# Altium project Mercury_AD_BaseBoard.PrjPcb (part 3 of 4)

## Sheet fastADCs.SchDoc
size A; SheetNumber: 4; SheetTotal: 24
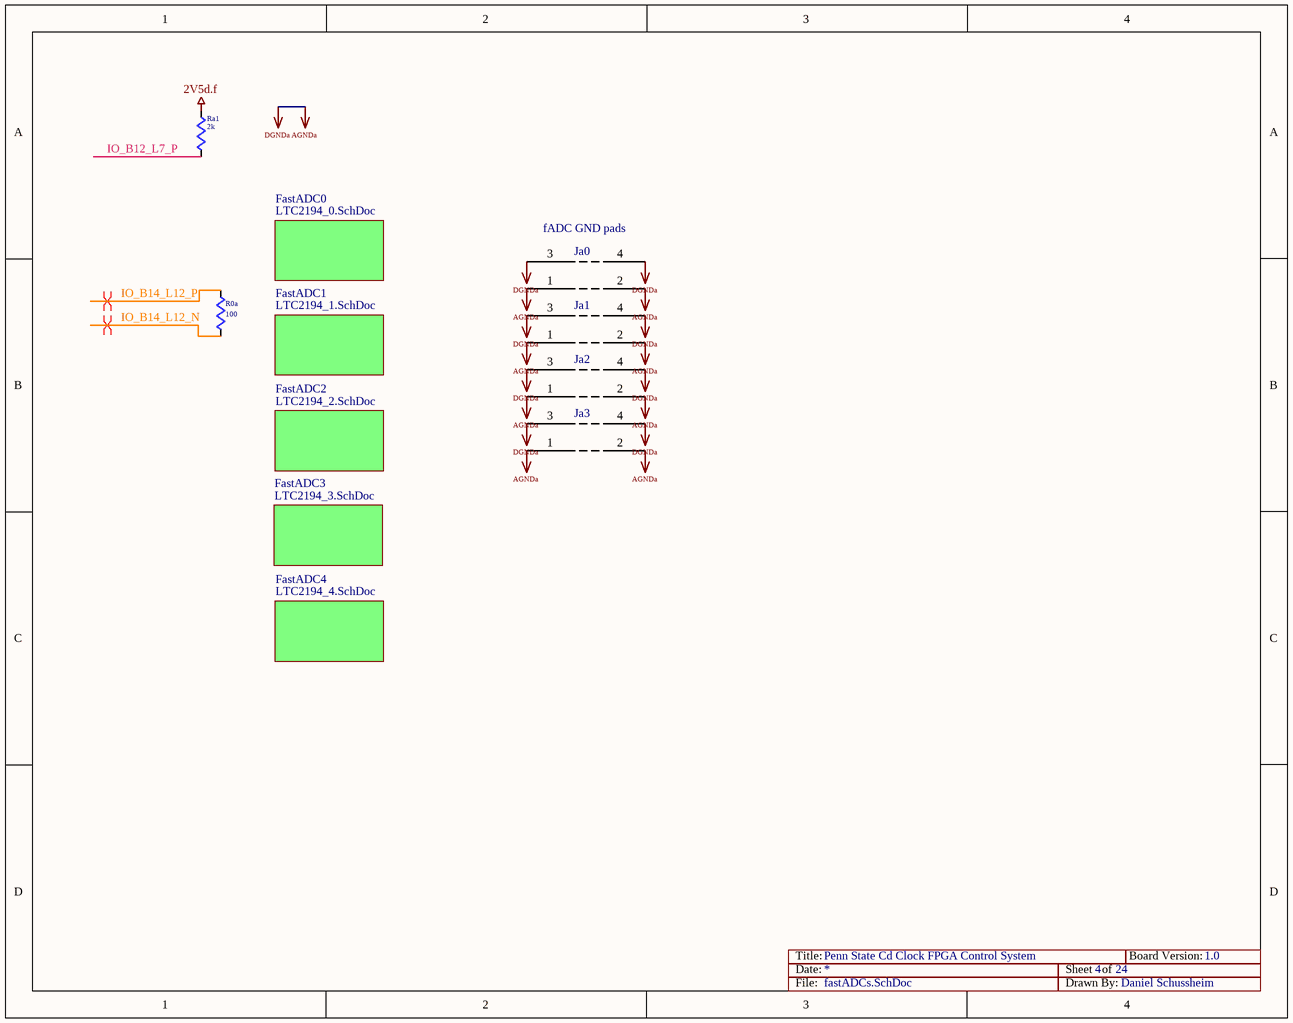
[diagram p17: fastADCs.SchDoc]

### Parts
Ja0  fADC GND pads  [FADC_GND_CONN]
Ja1  fADC GND pads  [FADC_GND_CONN]  (value not drawn)
Ja2  fADC GND pads  [FADC_GND_CONN]  (value not drawn)
Ja3  fADC GND pads  [FADC_GND_CONN]  (value not drawn)
R0a  100  [0402]
Ra1  2k  [0603]

### Sub-sheets
FastADC0 = LTC2194_0.SchDoc: no entries
FastADC1 = LTC2194_1.SchDoc: no entries
FastADC2 = LTC2194_2.SchDoc: no entries
FastADC3 = LTC2194_3.SchDoc: no entries
FastADC4 = LTC2194_4.SchDoc: no entries

### Nets
2V5d.f: Ra1.1
AGNDa: Ja0.1 Ja0.2 Ja0.3 Ja0.4 Ja1.1 Ja1.2 Ja1.3 Ja1.4 Ja2.1 Ja2.2 Ja2.3 Ja2.4 Ja3.1 Ja3.2 Ja3.3 Ja3.4  [also labelled DGNDa]
IO_B12_L7_P: Ra1.2
IO_B14_L12_N: R0a.2
IO_B14_L12_P: R0a.1

### Layout directives
differential pair: IO_B14_L12_N, IO_B14_L12_P

### Notes on the sheet
- Title:
- Date:
- Sheet
- of
- Board Version:
- File:
- Drawn By:

### Library data of the parts
R0a Ra1 = RES

## Sheet LTC2194_0.SchDoc
size A; DrawnBy: Daniel Schussheim; DocumentNumber: 2; SheetNumber: 5; SheetTotal: 24
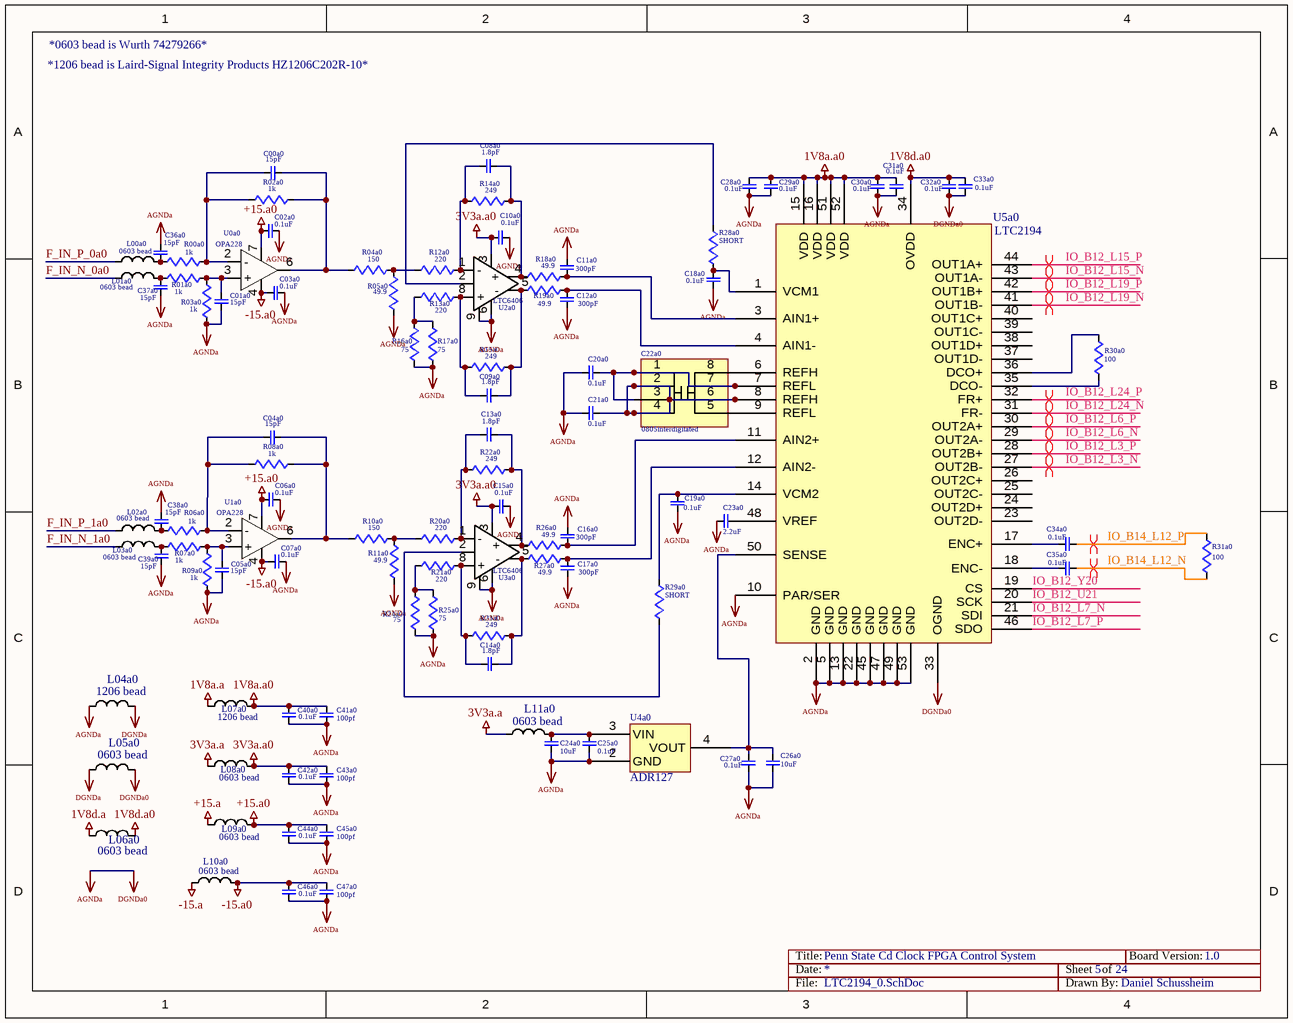
[diagram p18: LTC2194_0.SchDoc]

### Parts
C00a0  15pF  [0603]
C01a0  15pF  [0603]
C02a0  0.1uF  [0603]
C03a0  0.1uF  [0603]
C04a0  15pF  [0603]
C05a0  15pF  [0603]
C06a0  0.1uF  [0603]
C07a0  0.1uF  [0603]
C08a0  1.8pF  [0603]
C09a0  1.8pF  [0603]
C10a0  0.1uF  [0603]
C11a0  300pF  [0603]
C12a0  300pF  [0603]
C13a0  1.8pF  [0603]
C14a0  1.8pF  [0603]
C15a0  0.1uF  [0603]
C16a0  300pF  [0603]
C17a0  300pF  [0603]
C18a0  0.1uF  [0402]
C19a0  0.1uF  [0402]
C20a0  0.1uF  [0402]
C21a0  0.1uF  [0402]
C22a0  0805interdigitated  [0805int]
C23a0  2.2uF  [0402]
C24a0  10uF  [0603]
C25a0  0.1uF  [0603]
C26a0  10uF  [0603]
C27a0  0.1uF  [0603]
C28a0  0.1uF  [0402]
C29a0  0.1uF  [0402]
C30a0  0.1uF  [0402]
C31a0  0.1uF  [0402]
C32a0  0.1uF  [0402]
C33a0  0.1uF  [0402]
C34a0  0.1uF  [0402]
C35a0  0.1uF  [0402]
C36a0  15pF  [0603]
C37a0  15pF  [0603]
C38a0  15pF  [0603]
C39a0  15pF  [0603]
C40a0  0.1uF  [0603]
C41a0  100pf  [0603]
C42a0  0.1uF  [0603]
C43a0  100pf  [0603]
C44a0  0.1uF  [0603]
C45a0  100pf  [0603]
C46a0  0.1uF  [0603]
C47a0  100pf  [0603]
L00a0  0603 bead  [0603]
L01a0  0603 bead  [0603]
L02a0  0603 bead  [0603]
L03a0  0603 bead  [0603]
L04a0  1206 bead  [1206]
L05a0  0603 bead  [0603]
L06a0  0603 bead  [0603]
L07a0  1206 bead  [1206]
L08a0  0603 bead  [0603]
L09a0  0603 bead  [0603]
L10a0  0603 bead  [0603]
L11a0  0603 bead  [0603]
R00a0  1k  [0603]
R01a0  1k  [0603]
R02a0  1k  [0603]
R03a0  1k  [0603]
R04a0  150  [0603]
R05a0  49.9  [0603]
R06a0  1k  [0603]
R07a0  1k  [0603]
R08a0  1k  [0603]
R09a0  1k  [0603]
R10a0  150  [0603]
R11a0  49.9  [0603]
R12a0  220  [0603]
R13a0  220  [0603]
R14a0  249  [0603]
R15a0  249  [0603]
R16a0  75  [0603]
R17a0  75  [0603]
R18a0  49.9  [0603]
R19a0  49.9  [0603]
R20a0  220  [0603]
R21a0  220  [0603]
R22a0  249  [0603]
R23a0  249  [0603]
R24a0  75  [0603]
R25a0  75  [0603]
R26a0  49.9  [0603]
R27a0  49.9  [0603]
R28a0  SHORT  [0603]
R29a0  SHORT  [0603]
R30a0  100  [0603]
R31a0  100  [0402]
U0a0  OPA228  [8SOIC]
U1a0  OPA228  [8SOIC]
U2a0  LTC6406  [8MSOP]
U3a0  LTC6406  [8MSOP]
U4a0  ADR127  [6TSOT]
U5a0  LTC2194  [52QFN]

### Nets
1V8a.a: L07a0.1
1V8a.a0: C28a0.1 C29a0.1 C30a0.1 C31a0.1 C40a0.1 C41a0.1 L07a0.2 U5a0.15(VDD) U5a0.16(VDD) U5a0.51(VDD) U5a0.52(VDD)
1V8d.a: L06a0.1
1V8d.a0: C32a0.1 C33a0.2 L06a0.2 U5a0.34(OVDD)
3V3a.a: L08a0.1 L11a0.1
3V3a.a0: C10a0.1 C15a0.1 C42a0.1 C43a0.1 L08a0.2 U2a0.3(V+) U3a0.3(V+)
+15.a: L09a0.1
+15.a0: C02a0.2 C06a0.2 C44a0.1 C45a0.1 L09a0.2 U0a0.7(V+) U1a0.7(V+)
-15.a: L10a0.1
-15.a0: C03a0.2 C07a0.2 C46a0.1 C47a0.1 L10a0.2 U0a0.4(V-) U1a0.4(V-)
AGNDa: C01a0.2 C02a0.1 C03a0.1 C05a0.2 C06a0.1 C07a0.1 C10a0.2 C11a0.2 C12a0.1 C15a0.2 C16a0.2 C17a0.1 C18a0.1 C19a0.1 C20a0.2 C21a0.2 C23a0.2 C24a0.2 C25a0.2 C26a0.2 C27a0.2 C28a0.2 C29a0.2 C30a0.2 C31a0.2 C32a0.2 C33a0.1 C36a0.1 C37a0.2 C38a0.1 C39a0.2 C40a0.2 C41a0.2 C42a0.2 C43a0.2 C44a0.2 C45a0.2 C46a0.2 C47a0.2 L04a0.1 L04a0.2 L05a0.1 L05a0.2 R03a0.1 R05a0.2 R09a0.1 R11a0.2 R16a0.2 R17a0.2 R24a0.2 R25a0.2 U2a0.6(V-) U2a0.9(V-) U3a0.6(V-) U3a0.9(V-) U4a0.2(GND) U5a0.2(GND) U5a0.5(GND) U5a0.10(PAR/SER) U5a0.13(GND) U5a0.22(GND) U5a0.33(OGND) U5a0.45(GND) U5a0.47(GND) U5a0.49(GND) U5a0.53(GND)  [also labelled DGNDa, DGNDa0]
F_IN_N_0a0: L01a0.1
F_IN_N_1a0: L03a0.1
F_IN_P_0a0: L00a0.1
F_IN_P_1a0: L02a0.1
IO_B12_L3_N: U5a0.27(OUT2B-)
IO_B12_L3_P: U5a0.28(OUT2B+)
IO_B12_L6_N: U5a0.29(OUT2A-)
IO_B12_L6_P: U5a0.30(OUT2A+)
IO_B12_L7_N: U5a0.21(SDI)
IO_B12_L7_P: U5a0.46(SDO)
IO_B12_L15_N: U5a0.43(OUT1A-)
IO_B12_L15_P: U5a0.44(OUT1A+)
IO_B12_L19_N: U5a0.41(OUT1B-)
IO_B12_L19_P: U5a0.42(OUT1B+)
IO_B12_L24_N: U5a0.31(FR-)
IO_B12_L24_P: U5a0.32(FR+)
IO_B12_U21: U5a0.20(SCK)
IO_B12_Y20: U5a0.19(CS)
IO_B14_L12_N: C35a0.1 R31a0.2
IO_B14_L12_P: C34a0.1 R31a0.1
NetC00a0_1: C00a0.1 R00a0.1 R02a0.2 U0a0.2(-)
NetC00a0_2: C00a0.2 R02a0.1 R04a0.2 U0a0.6(OUT)
NetC01a0_1: C01a0.1 R01a0.1 R03a0.2 U0a0.3(+)
NetC04a0_1: C04a0.1 R06a0.1 R08a0.2 U1a0.2(-)
NetC04a0_2: C04a0.2 R08a0.1 R10a0.2 U1a0.6(OUT)
NetC05a0_1: C05a0.1 R07a0.1 R09a0.2 U1a0.3(+)
NetC08a0_1: C08a0.1 R12a0.1 R14a0.2 U2a0.1(-)
NetC08a0_2: C08a0.2 R14a0.1 R18a0.2 U2a0.4(+)
NetC09a0_1: C09a0.1 R13a0.1 R15a0.2 U2a0.8(+)
NetC09a0_2: C09a0.2 R15a0.1 R19a0.2 U2a0.5(-)
NetC11a0_1: C11a0.1 R18a0.1 U5a0.3(AIN1+)
NetC12a0_2: C12a0.2 R19a0.1 U5a0.4(AIN1-)
NetC13a0_1: C13a0.1 R20a0.1 R22a0.2 U3a0.1(-)
NetC13a0_2: C13a0.2 R22a0.1 R26a0.2 U3a0.4(+)
NetC14a0_1: C14a0.1 R21a0.1 R23a0.2 U3a0.8(+)
NetC14a0_2: C14a0.2 R23a0.1 R27a0.2 U3a0.5(-)
NetC16a0_1: C16a0.1 R26a0.1 U5a0.11(AIN2+)
NetC17a0_2: C17a0.2 R27a0.1 U5a0.12(AIN2-)
NetC18a0_2: C18a0.2 R28a0.2 U5a0.1(VCM1)
NetC19a0_2: C19a0.2 R29a0.1 U5a0.14(VCM2)
NetC20a0_1: C20a0.1 C22a0.1 C22a0.3 C22a0.7 U5a0.7(REFL)
NetC21a0_1: C21a0.1 C22a0.2 C22a0.4 C22a0.6 U5a0.8(REFH)
NetC22a0_5: C22a0.5 U5a0.9(REFL)
NetC22a0_8: C22a0.8 U5a0.6(REFH)
NetC23a0_1: C23a0.1 U5a0.48(VREF)
NetC24a0_1: C24a0.1 C25a0.1 L11a0.2 U4a0.3(VIN)
NetC26a0_1: C26a0.1 C27a0.1 U4a0.4(VOUT) U5a0.50(SENSE)
NetC34a0_2: C34a0.2 U5a0.17(ENC+)
NetC35a0_2: C35a0.2 U5a0.18(ENC-)
NetC36a0_2: C36a0.2 L00a0.2 R00a0.2
NetC37a0_1: C37a0.1 L01a0.2 R01a0.2
NetC38a0_2: C38a0.2 L02a0.2 R06a0.2
NetC39a0_1: C39a0.1 L03a0.2 R07a0.2
NetR04a0_1: R04a0.1 R05a0.1 R12a0.2
NetR10a0_1: R10a0.1 R11a0.1 R20a0.2
NetR13a0_2: R13a0.2 R16a0.1 R17a0.1
NetR21a0_2: R21a0.2 R24a0.1 R25a0.1
NetR28a0_1: R28a0.1 U2a0.2(VOCM)
NetR29a0_2: R29a0.2 U3a0.2(VOCM)
NetR30a0_1: R30a0.1 U5a0.36(DCO+)
NetR30a0_2: R30a0.2 U5a0.35(DCO-)

Not connected (* = marked no-connect by the designer): U5a0 23(OUT2D-) 24(OUT2D+) 25(OUT2C-) 26(OUT2C+) 37(OUT1D-) 38(OUT1D+) 39(OUT1C-) 40(OUT1C+)

### Layout directives
differential pair: IO_B12_L3_N, IO_B12_L3_P, IO_B12_L6_N, IO_B12_L6_P, IO_B12_L15_N, IO_B12_L15_P, IO_B12_L19_N, IO_B12_L19_P, IO_B12_L24_N, IO_B12_L24_P, IO_B14_L12_N, IO_B14_L12_P

### Notes on the sheet
- *1206 bead is Laird-Signal Integrity Products HZ1206C202R-10*
- *0603 bead is Wurth 74279266*
- Title:
- Date:
- Sheet
- of
- Board Version:
- File:
- Drawn By:

### Library data of the parts
C00a0 C01a0 C02a0 C03a0 C04a0 C05a0 C06a0 C07a0 C08a0 C09a0 C10a0 C11a0 C12a0 C13a0 C14a0 C15a0 C16a0 C17a0 C18a0 C19a0 C20a0 C21a0 C23a0 C24a0 C25a0 C26a0 C27a0 C28a0 C29a0 C30a0 C31a0 C32a0 C33a0 C34a0 C35a0 C36a0 C37a0 C38a0 C39a0 C40a0 C41a0 C42a0 C43a0 C44a0 C45a0 C46a0 C47a0 = CAP
C22a0 = 0805intCap
L00a0 L01a0 L02a0 L03a0 L04a0 L05a0 L06a0 L07a0 L08a0 L09a0 L10a0 L11a0 = INDUCTOR
R00a0 R01a0 R02a0 R03a0 R04a0 R05a0 R06a0 R07a0 R08a0 R09a0 R10a0 R11a0 R12a0 R13a0 R14a0 R15a0 R16a0 R17a0 R18a0 R19a0 R20a0 R21a0 R22a0 R23a0 R24a0 R25a0 R26a0 R27a0 R28a0 R29a0 R30a0 R31a0 = RES
U0a0 U1a0 = LF356
U4a0 = ADR12x

## Sheet LTC2194_1.SchDoc
size A; SheetNumber: 6; SheetTotal: 24
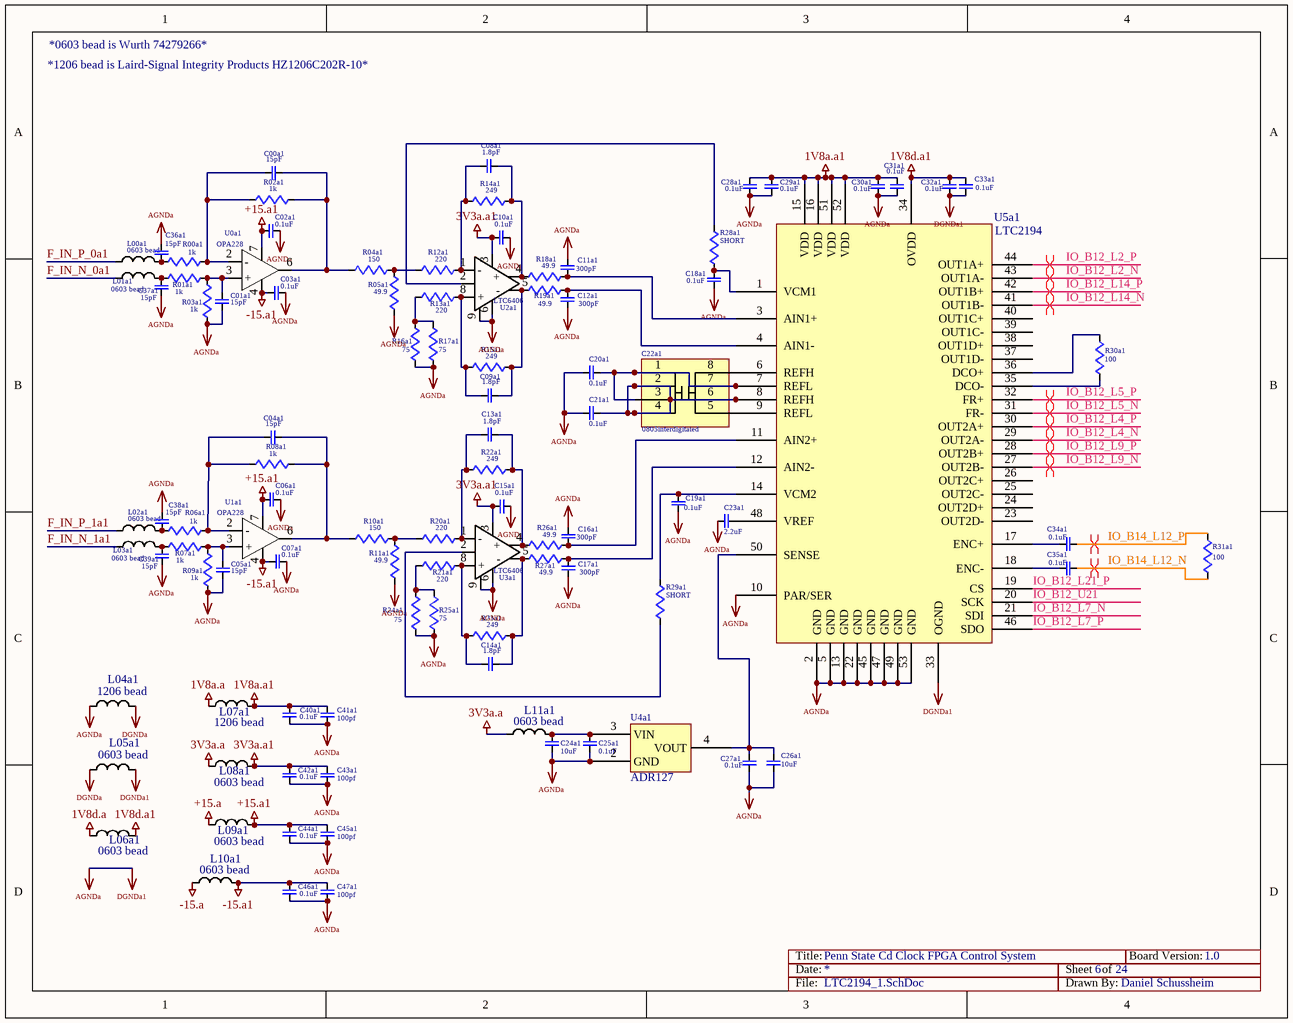
[diagram p19: LTC2194_1.SchDoc]

### Parts
C00a1  15pF  [0603]
C01a1  15pF  [0603]
C02a1  0.1uF  [0603]
C03a1  0.1uF  [0603]
C04a1  15pF  [0603]
C05a1  15pF  [0603]
C06a1  0.1uF  [0603]
C07a1  0.1uF  [0603]
C08a1  1.8pF  [0603]
C09a1  1.8pF  [0603]
C10a1  0.1uF  [0603]
C11a1  300pF  [0603]
C12a1  300pF  [0603]
C13a1  1.8pF  [0603]
C14a1  1.8pF  [0603]
C15a1  0.1uF  [0603]
C16a1  300pF  [0603]
C17a1  300pF  [0603]
C18a1  0.1uF  [0402]
C19a1  0.1uF  [0402]
C20a1  0.1uF  [0402]
C21a1  0.1uF  [0402]
C22a1  0805interdigitated  [0805int]
C23a1  2.2uF  [0402]
C24a1  10uF  [0603]
C25a1  0.1uF  [0603]
C26a1  10uF  [0603]
C27a1  0.1uF  [0603]
C28a1  0.1uF  [0402]
C29a1  0.1uF  [0402]
C30a1  0.1uF  [0402]
C31a1  0.1uF  [0402]
C32a1  0.1uF  [0402]
C33a1  0.1uF  [0402]
C34a1  0.1uF  [0402]
C35a1  0.1uF  [0402]
C36a1  15pF  [0603]
C37a1  15pF  [0603]
C38a1  15pF  [0603]
C39a1  15pF  [0603]
C40a1  0.1uF  [0603]
C41a1  100pf  [0603]
C42a1  0.1uF  [0603]
C43a1  100pf  [0603]
C44a1  0.1uF  [0603]
C45a1  100pf  [0603]
C46a1  0.1uF  [0603]
C47a1  100pf  [0603]
L00a1  0603 bead  [0603]
L01a1  0603 bead  [0603]
L02a1  0603 bead  [0603]
L03a1  0603 bead  [0603]
L04a1  1206 bead  [1206]
L05a1  0603 bead  [0603]
L06a1  0603 bead  [0603]
L07a1  1206 bead  [1206]
L08a1  0603 bead  [0603]
L09a1  0603 bead  [0603]
L10a1  0603 bead  [0603]
L11a1  0603 bead  [0603]
R00a1  1k  [0603]
R01a1  1k  [0603]
R02a1  1k  [0603]
R03a1  1k  [0603]
R04a1  150  [0603]
R05a1  49.9  [0603]
R06a1  1k  [0603]
R07a1  1k  [0603]
R08a1  1k  [0603]
R09a1  1k  [0603]
R10a1  150  [0603]
R11a1  49.9  [0603]
R12a1  220  [0603]
R13a1  220  [0603]
R14a1  249  [0603]
R15a1  249  [0603]
R16a1  75  [0603]
R17a1  75  [0603]
R18a1  49.9  [0603]
R19a1  49.9  [0603]
R20a1  220  [0603]
R21a1  220  [0603]
R22a1  249  [0603]
R23a1  249  [0603]
R24a1  75  [0603]
R25a1  75  [0603]
R26a1  49.9  [0603]
R27a1  49.9  [0603]
R28a1  SHORT  [0603]
R29a1  SHORT  [0603]
R30a1  100  [0603]
R31a1  100  [0402]
U0a1  OPA228  [8SOIC]
U1a1  OPA228  [8SOIC]
U2a1  LTC6406  [8MSOP]
U3a1  LTC6406  [8MSOP]
U4a1  ADR127  [6TSOT]
U5a1  LTC2194  [52QFN]

### Nets
1V8a.a: L07a1.1
1V8a.a1: C28a1.1 C29a1.1 C30a1.1 C31a1.1 C40a1.1 C41a1.1 L07a1.2 U5a1.15(VDD) U5a1.16(VDD) U5a1.51(VDD) U5a1.52(VDD)
1V8d.a: L06a1.1
1V8d.a1: C32a1.1 C33a1.2 L06a1.2 U5a1.34(OVDD)
3V3a.a: L08a1.1 L11a1.1
3V3a.a1: C10a1.1 C15a1.1 C42a1.1 C43a1.1 L08a1.2 U2a1.3(V+) U3a1.3(V+)
+15.a: L09a1.1
+15.a1: C02a1.2 C06a1.2 C44a1.1 C45a1.1 L09a1.2 U0a1.7(V+) U1a1.7(V+)
-15.a: L10a1.1
-15.a1: C03a1.2 C07a1.2 C46a1.1 C47a1.1 L10a1.2 U0a1.4(V-) U1a1.4(V-)
AGNDa: C01a1.2 C02a1.1 C03a1.1 C05a1.2 C06a1.1 C07a1.1 C10a1.2 C11a1.2 C12a1.1 C15a1.2 C16a1.2 C17a1.1 C18a1.1 C19a1.1 C20a1.2 C21a1.2 C23a1.2 C24a1.2 C25a1.2 C26a1.2 C27a1.2 C28a1.2 C29a1.2 C30a1.2 C31a1.2 C32a1.2 C33a1.1 C36a1.1 C37a1.2 C38a1.1 C39a1.2 C40a1.2 C41a1.2 C42a1.2 C43a1.2 C44a1.2 C45a1.2 C46a1.2 C47a1.2 L04a1.1 L04a1.2 L05a1.1 L05a1.2 R03a1.1 R05a1.2 R09a1.1 R11a1.2 R16a1.2 R17a1.2 R24a1.2 R25a1.2 U2a1.6(V-) U2a1.9(V-) U3a1.6(V-) U3a1.9(V-) U4a1.2(GND) U5a1.2(GND) U5a1.5(GND) U5a1.10(PAR/SER) U5a1.13(GND) U5a1.22(GND) U5a1.33(OGND) U5a1.45(GND) U5a1.47(GND) U5a1.49(GND) U5a1.53(GND)  [also labelled DGNDa, DGNDa1]
F_IN_N_0a1: L01a1.1
F_IN_N_1a1: L03a1.1
F_IN_P_0a1: L00a1.1
F_IN_P_1a1: L02a1.1
IO_B12_L2_N: U5a1.43(OUT1A-)
IO_B12_L2_P: U5a1.44(OUT1A+)
IO_B12_L4_N: U5a1.29(OUT2A-)
IO_B12_L4_P: U5a1.30(OUT2A+)
IO_B12_L5_N: U5a1.31(FR-)
IO_B12_L5_P: U5a1.32(FR+)
IO_B12_L7_N: U5a1.21(SDI)
IO_B12_L7_P: U5a1.46(SDO)
IO_B12_L9_N: U5a1.27(OUT2B-)
IO_B12_L9_P: U5a1.28(OUT2B+)
IO_B12_L14_N: U5a1.41(OUT1B-)
IO_B12_L14_P: U5a1.42(OUT1B+)
IO_B12_L21_P: U5a1.19(CS)
IO_B12_U21: U5a1.20(SCK)
IO_B14_L12_N: C35a1.1 R31a1.2
IO_B14_L12_P: C34a1.1 R31a1.1
NetC00a1_1: C00a1.1 R00a1.1 R02a1.2 U0a1.2(-)
NetC00a1_2: C00a1.2 R02a1.1 R04a1.2 U0a1.6(OUT)
NetC01a1_1: C01a1.1 R01a1.1 R03a1.2 U0a1.3(+)
NetC04a1_1: C04a1.1 R06a1.1 R08a1.2 U1a1.2(-)
NetC04a1_2: C04a1.2 R08a1.1 R10a1.2 U1a1.6(OUT)
NetC05a1_1: C05a1.1 R07a1.1 R09a1.2 U1a1.3(+)
NetC08a1_1: C08a1.1 R12a1.1 R14a1.2 U2a1.1(-)
NetC08a1_2: C08a1.2 R14a1.1 R18a1.2 U2a1.4(+)
NetC09a1_1: C09a1.1 R13a1.1 R15a1.2 U2a1.8(+)
NetC09a1_2: C09a1.2 R15a1.1 R19a1.2 U2a1.5(-)
NetC11a1_1: C11a1.1 R18a1.1 U5a1.3(AIN1+)
NetC12a1_2: C12a1.2 R19a1.1 U5a1.4(AIN1-)
NetC13a1_1: C13a1.1 R20a1.1 R22a1.2 U3a1.1(-)
NetC13a1_2: C13a1.2 R22a1.1 R26a1.2 U3a1.4(+)
NetC14a1_1: C14a1.1 R21a1.1 R23a1.2 U3a1.8(+)
NetC14a1_2: C14a1.2 R23a1.1 R27a1.2 U3a1.5(-)
NetC16a1_1: C16a1.1 R26a1.1 U5a1.11(AIN2+)
NetC17a1_2: C17a1.2 R27a1.1 U5a1.12(AIN2-)
NetC18a1_2: C18a1.2 R28a1.2 U5a1.1(VCM1)
NetC19a1_2: C19a1.2 R29a1.1 U5a1.14(VCM2)
NetC20a1_1: C20a1.1 C22a1.1 C22a1.3 C22a1.7 U5a1.7(REFL)
NetC21a1_1: C21a1.1 C22a1.2 C22a1.4 C22a1.6 U5a1.8(REFH)
NetC22a1_5: C22a1.5 U5a1.9(REFL)
NetC22a1_8: C22a1.8 U5a1.6(REFH)
NetC23a1_1: C23a1.1 U5a1.48(VREF)
NetC24a1_1: C24a1.1 C25a1.1 L11a1.2 U4a1.3(VIN)
NetC26a1_1: C26a1.1 C27a1.1 U4a1.4(VOUT) U5a1.50(SENSE)
NetC34a1_2: C34a1.2 U5a1.17(ENC+)
NetC35a1_2: C35a1.2 U5a1.18(ENC-)
NetC36a1_2: C36a1.2 L00a1.2 R00a1.2
NetC37a1_1: C37a1.1 L01a1.2 R01a1.2
NetC38a1_2: C38a1.2 L02a1.2 R06a1.2
NetC39a1_1: C39a1.1 L03a1.2 R07a1.2
NetR04a1_1: R04a1.1 R05a1.1 R12a1.2
NetR10a1_1: R10a1.1 R11a1.1 R20a1.2
NetR13a1_2: R13a1.2 R16a1.1 R17a1.1
NetR21a1_2: R21a1.2 R24a1.1 R25a1.1
NetR28a1_1: R28a1.1 U2a1.2(VOCM)
NetR29a1_2: R29a1.2 U3a1.2(VOCM)
NetR30a1_1: R30a1.1 U5a1.36(DCO+)
NetR30a1_2: R30a1.2 U5a1.35(DCO-)

Not connected (* = marked no-connect by the designer): U5a1 23(OUT2D-) 24(OUT2D+) 25(OUT2C-) 26(OUT2C+) 37(OUT1D-) 38(OUT1D+) 39(OUT1C-) 40(OUT1C+)

### Layout directives
differential pair: IO_B12_L2_N, IO_B12_L2_P, IO_B12_L4_N, IO_B12_L4_P, IO_B12_L5_N, IO_B12_L5_P, IO_B12_L9_N, IO_B12_L9_P, IO_B12_L14_N, IO_B12_L14_P, IO_B14_L12_N, IO_B14_L12_P

### Notes on the sheet
- *1206 bead is Laird-Signal Integrity Products HZ1206C202R-10*
- *0603 bead is Wurth 74279266*
- Title:
- Date:
- Sheet
- of
- Board Version:
- File:
- Drawn By:

### Library data of the parts
C00a1 C01a1 C02a1 C03a1 C04a1 C05a1 C06a1 C07a1 C08a1 C09a1 C10a1 C11a1 C12a1 C13a1 C14a1 C15a1 C16a1 C17a1 C18a1 C19a1 C20a1 C21a1 C23a1 C24a1 C25a1 C26a1 C27a1 C28a1 C29a1 C30a1 C31a1 C32a1 C33a1 C34a1 C35a1 C36a1 C37a1 C38a1 C39a1 C40a1 C41a1 C42a1 C43a1 C44a1 C45a1 C46a1 C47a1 = CAP
C22a1 = 0805intCap
L00a1 L01a1 L02a1 L03a1 L04a1 L05a1 L06a1 L07a1 L08a1 L09a1 L10a1 L11a1 = INDUCTOR
R00a1 R01a1 R02a1 R03a1 R04a1 R05a1 R06a1 R07a1 R08a1 R09a1 R10a1 R11a1 R12a1 R13a1 R14a1 R15a1 R16a1 R17a1 R18a1 R19a1 R20a1 R21a1 R22a1 R23a1 R24a1 R25a1 R26a1 R27a1 R28a1 R29a1 R30a1 R31a1 = RES
U0a1 U1a1 = LF356
U4a1 = ADR12x

## Sheet LTC2194_2.SchDoc
size A; SheetNumber: 7; SheetTotal: 24
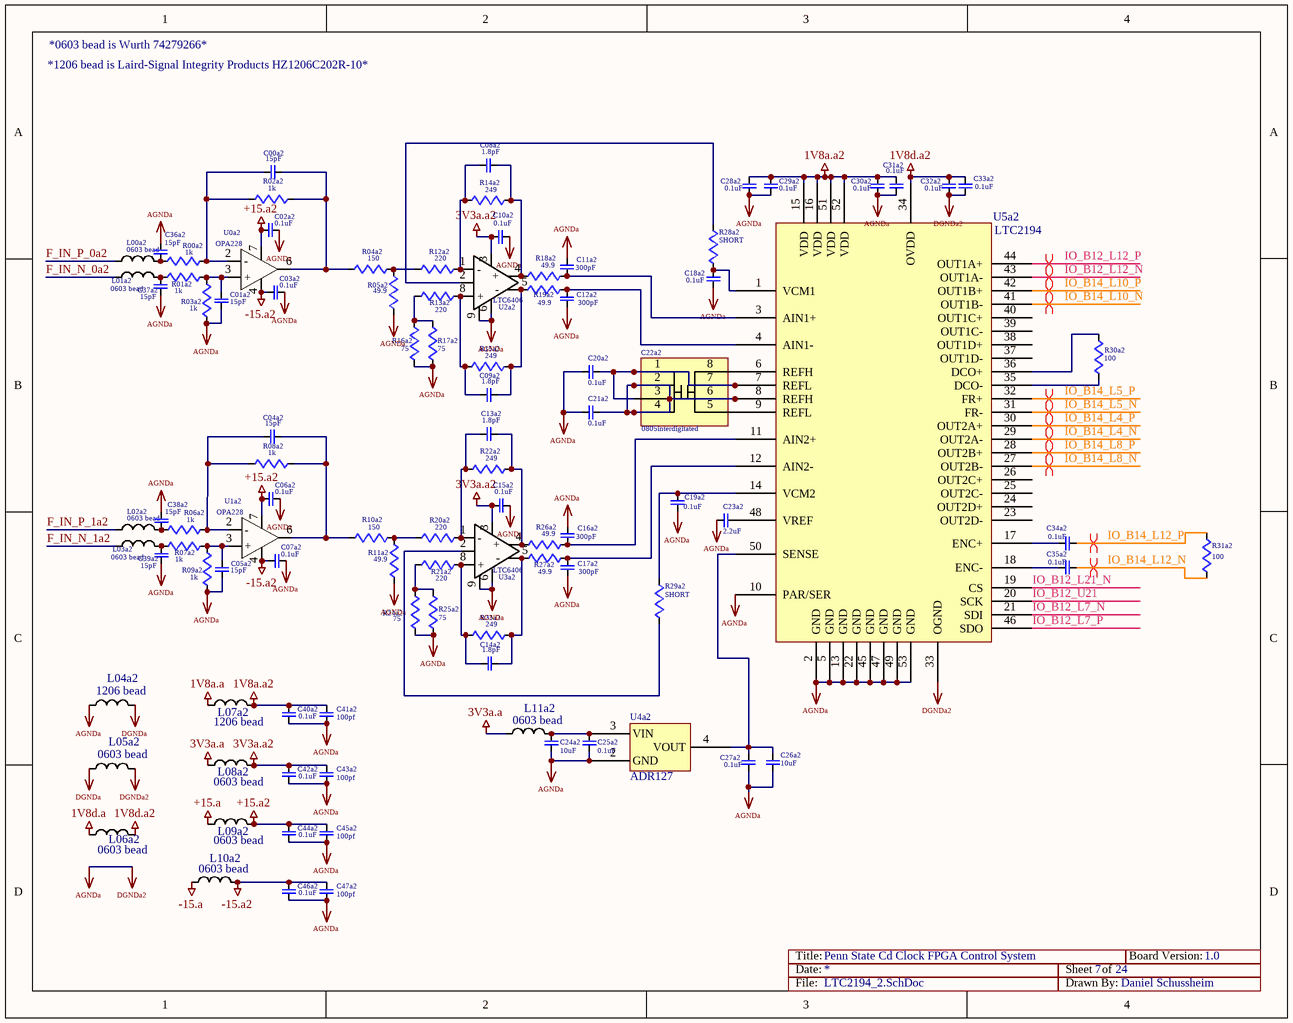
[diagram p20: LTC2194_2.SchDoc]

### Parts
C00a2  15pF  [0603]
C01a2  15pF  [0603]
C02a2  0.1uF  [0603]
C03a2  0.1uF  [0603]
C04a2  15pF  [0603]
C05a2  15pF  [0603]
C06a2  0.1uF  [0603]
C07a2  0.1uF  [0603]
C08a2  1.8pF  [0603]
C09a2  1.8pF  [0603]
C10a2  0.1uF  [0603]
C11a2  300pF  [0603]
C12a2  300pF  [0603]
C13a2  1.8pF  [0603]
C14a2  1.8pF  [0603]
C15a2  0.1uF  [0603]
C16a2  300pF  [0603]
C17a2  300pF  [0603]
C18a2  0.1uF  [0402]
C19a2  0.1uF  [0402]
C20a2  0.1uF  [0402]
C21a2  0.1uF  [0402]
C22a2  0805interdigitated  [0805int]
C23a2  2.2uF  [0402]
C24a2  10uF  [0603]
C25a2  0.1uF  [0603]
C26a2  10uF  [0603]
C27a2  0.1uF  [0603]
C28a2  0.1uF  [0402]
C29a2  0.1uF  [0402]
C30a2  0.1uF  [0402]
C31a2  0.1uF  [0402]
C32a2  0.1uF  [0402]
C33a2  0.1uF  [0402]
C34a2  0.1uF  [0402]
C35a2  0.1uF  [0402]
C36a2  15pF  [0603]
C37a2  15pF  [0603]
C38a2  15pF  [0603]
C39a2  15pF  [0603]
C40a2  0.1uF  [0603]
C41a2  100pf  [0603]
C42a2  0.1uF  [0603]
C43a2  100pf  [0603]
C44a2  0.1uF  [0603]
C45a2  100pf  [0603]
C46a2  0.1uF  [0603]
C47a2  100pf  [0603]
L00a2  0603 bead  [0603]
L01a2  0603 bead  [0603]
L02a2  0603 bead  [0603]
L03a2  0603 bead  [0603]
L04a2  1206 bead  [1206]
L05a2  0603 bead  [0603]
L06a2  0603 bead  [0603]
L07a2  1206 bead  [1206]
L08a2  0603 bead  [0603]
L09a2  0603 bead  [0603]
L10a2  0603 bead  [0603]
L11a2  0603 bead  [0603]
R00a2  1k  [0603]
R01a2  1k  [0603]
R02a2  1k  [0603]
R03a2  1k  [0603]
R04a2  150  [0603]
R05a2  49.9  [0603]
R06a2  1k  [0603]
R07a2  1k  [0603]
R08a2  1k  [0603]
R09a2  1k  [0603]
R10a2  150  [0603]
R11a2  49.9  [0603]
R12a2  220  [0603]
R13a2  220  [0603]
R14a2  249  [0603]
R15a2  249  [0603]
R16a2  75  [0603]
R17a2  75  [0603]
R18a2  49.9  [0603]
R19a2  49.9  [0603]
R20a2  220  [0603]
R21a2  220  [0603]
R22a2  249  [0603]
R23a2  249  [0603]
R24a2  75  [0603]
R25a2  75  [0603]
R26a2  49.9  [0603]
R27a2  49.9  [0603]
R28a2  SHORT  [0603]
R29a2  SHORT  [0603]
R30a2  100  [0603]
R31a2  100  [0402]
U0a2  OPA228  [8SOIC]
U1a2  OPA228  [8SOIC]
U2a2  LTC6406  [8MSOP]
U3a2  LTC6406  [8MSOP]
U4a2  ADR127  [6TSOT]
U5a2  LTC2194  [52QFN]

### Nets
1V8a.a: L07a2.1
1V8a.a2: C28a2.1 C29a2.1 C30a2.1 C31a2.1 C40a2.1 C41a2.1 L07a2.2 U5a2.15(VDD) U5a2.16(VDD) U5a2.51(VDD) U5a2.52(VDD)
1V8d.a: L06a2.1
1V8d.a2: C32a2.1 C33a2.2 L06a2.2 U5a2.34(OVDD)
3V3a.a: L08a2.1 L11a2.1
3V3a.a2: C10a2.1 C15a2.1 C42a2.1 C43a2.1 L08a2.2 U2a2.3(V+) U3a2.3(V+)
+15.a: L09a2.1
+15.a2: C02a2.2 C06a2.2 C44a2.1 C45a2.1 L09a2.2 U0a2.7(V+) U1a2.7(V+)
-15.a: L10a2.1
-15.a2: C03a2.2 C07a2.2 C46a2.1 C47a2.1 L10a2.2 U0a2.4(V-) U1a2.4(V-)
AGNDa: C01a2.2 C02a2.1 C03a2.1 C05a2.2 C06a2.1 C07a2.1 C10a2.2 C11a2.2 C12a2.1 C15a2.2 C16a2.2 C17a2.1 C18a2.1 C19a2.1 C20a2.2 C21a2.2 C23a2.2 C24a2.2 C25a2.2 C26a2.2 C27a2.2 C28a2.2 C29a2.2 C30a2.2 C31a2.2 C32a2.2 C33a2.1 C36a2.1 C37a2.2 C38a2.1 C39a2.2 C40a2.2 C41a2.2 C42a2.2 C43a2.2 C44a2.2 C45a2.2 C46a2.2 C47a2.2 L04a2.1 L04a2.2 L05a2.1 L05a2.2 R03a2.1 R05a2.2 R09a2.1 R11a2.2 R16a2.2 R17a2.2 R24a2.2 R25a2.2 U2a2.6(V-) U2a2.9(V-) U3a2.6(V-) U3a2.9(V-) U4a2.2(GND) U5a2.2(GND) U5a2.5(GND) U5a2.10(PAR/SER) U5a2.13(GND) U5a2.22(GND) U5a2.33(OGND) U5a2.45(GND) U5a2.47(GND) U5a2.49(GND) U5a2.53(GND)  [also labelled DGNDa, DGNDa2]
F_IN_N_0a2: L01a2.1
F_IN_N_1a2: L03a2.1
F_IN_P_0a2: L00a2.1
F_IN_P_1a2: L02a2.1
IO_B12_L7_N: U5a2.21(SDI)
IO_B12_L7_P: U5a2.46(SDO)
IO_B12_L12_N: U5a2.43(OUT1A-)
IO_B12_L12_P: U5a2.44(OUT1A+)
IO_B12_L21_N: U5a2.19(CS)
IO_B12_U21: U5a2.20(SCK)
IO_B14_L4_N: U5a2.29(OUT2A-)
IO_B14_L4_P: U5a2.30(OUT2A+)
IO_B14_L5_N: U5a2.31(FR-)
IO_B14_L5_P: U5a2.32(FR+)
IO_B14_L8_N: U5a2.27(OUT2B-)
IO_B14_L8_P: U5a2.28(OUT2B+)
IO_B14_L10_N: U5a2.41(OUT1B-)
IO_B14_L10_P: U5a2.42(OUT1B+)
IO_B14_L12_N: C35a2.1 R31a2.2
IO_B14_L12_P: C34a2.1 R31a2.1
NetC00a2_1: C00a2.1 R00a2.1 R02a2.2 U0a2.2(-)
NetC00a2_2: C00a2.2 R02a2.1 R04a2.2 U0a2.6(OUT)
NetC01a2_1: C01a2.1 R01a2.1 R03a2.2 U0a2.3(+)
NetC04a2_1: C04a2.1 R06a2.1 R08a2.2 U1a2.2(-)
NetC04a2_2: C04a2.2 R08a2.1 R10a2.2 U1a2.6(OUT)
NetC05a2_1: C05a2.1 R07a2.1 R09a2.2 U1a2.3(+)
NetC08a2_1: C08a2.1 R12a2.1 R14a2.2 U2a2.1(-)
NetC08a2_2: C08a2.2 R14a2.1 R18a2.2 U2a2.4(+)
NetC09a2_1: C09a2.1 R13a2.1 R15a2.2 U2a2.8(+)
NetC09a2_2: C09a2.2 R15a2.1 R19a2.2 U2a2.5(-)
NetC11a2_1: C11a2.1 R18a2.1 U5a2.3(AIN1+)
NetC12a2_2: C12a2.2 R19a2.1 U5a2.4(AIN1-)
NetC13a2_1: C13a2.1 R20a2.1 R22a2.2 U3a2.1(-)
NetC13a2_2: C13a2.2 R22a2.1 R26a2.2 U3a2.4(+)
NetC14a2_1: C14a2.1 R21a2.1 R23a2.2 U3a2.8(+)
NetC14a2_2: C14a2.2 R23a2.1 R27a2.2 U3a2.5(-)
NetC16a2_1: C16a2.1 R26a2.1 U5a2.11(AIN2+)
NetC17a2_2: C17a2.2 R27a2.1 U5a2.12(AIN2-)
NetC18a2_2: C18a2.2 R28a2.2 U5a2.1(VCM1)
NetC19a2_2: C19a2.2 R29a2.1 U5a2.14(VCM2)
NetC20a2_1: C20a2.1 C22a2.1 C22a2.3 C22a2.7 U5a2.7(REFL)
NetC21a2_1: C21a2.1 C22a2.2 C22a2.4 C22a2.6 U5a2.8(REFH)
NetC22a2_5: C22a2.5 U5a2.9(REFL)
NetC22a2_8: C22a2.8 U5a2.6(REFH)
NetC23a2_1: C23a2.1 U5a2.48(VREF)
NetC24a2_1: C24a2.1 C25a2.1 L11a2.2 U4a2.3(VIN)
NetC26a2_1: C26a2.1 C27a2.1 U4a2.4(VOUT) U5a2.50(SENSE)
NetC34a2_2: C34a2.2 U5a2.17(ENC+)
NetC35a2_2: C35a2.2 U5a2.18(ENC-)
NetC36a2_2: C36a2.2 L00a2.2 R00a2.2
NetC37a2_1: C37a2.1 L01a2.2 R01a2.2
NetC38a2_2: C38a2.2 L02a2.2 R06a2.2
NetC39a2_1: C39a2.1 L03a2.2 R07a2.2
NetR04a2_1: R04a2.1 R05a2.1 R12a2.2
NetR10a2_1: R10a2.1 R11a2.1 R20a2.2
NetR13a2_2: R13a2.2 R16a2.1 R17a2.1
NetR21a2_2: R21a2.2 R24a2.1 R25a2.1
NetR28a2_1: R28a2.1 U2a2.2(VOCM)
NetR29a2_2: R29a2.2 U3a2.2(VOCM)
NetR30a2_1: R30a2.1 U5a2.36(DCO+)
NetR30a2_2: R30a2.2 U5a2.35(DCO-)

Not connected (* = marked no-connect by the designer): U5a2 23(OUT2D-) 24(OUT2D+) 25(OUT2C-) 26(OUT2C+) 37(OUT1D-) 38(OUT1D+) 39(OUT1C-) 40(OUT1C+)

### Layout directives
differential pair: IO_B12_L12_N, IO_B12_L12_P, IO_B14_L4_N, IO_B14_L4_P, IO_B14_L5_N, IO_B14_L5_P, IO_B14_L8_N, IO_B14_L8_P, IO_B14_L10_N, IO_B14_L10_P, IO_B14_L12_N, IO_B14_L12_P

### Notes on the sheet
- *1206 bead is Laird-Signal Integrity Products HZ1206C202R-10*
- *0603 bead is Wurth 74279266*
- Title:
- Date:
- Sheet
- of
- Board Version:
- File:
- Drawn By:

### Library data of the parts
C00a2 C01a2 C02a2 C03a2 C04a2 C05a2 C06a2 C07a2 C08a2 C09a2 C10a2 C11a2 C12a2 C13a2 C14a2 C15a2 C16a2 C17a2 C18a2 C19a2 C20a2 C21a2 C23a2 C24a2 C25a2 C26a2 C27a2 C28a2 C29a2 C30a2 C31a2 C32a2 C33a2 C34a2 C35a2 C36a2 C37a2 C38a2 C39a2 C40a2 C41a2 C42a2 C43a2 C44a2 C45a2 C46a2 C47a2 = CAP
C22a2 = 0805intCap
L00a2 L01a2 L02a2 L03a2 L04a2 L05a2 L06a2 L07a2 L08a2 L09a2 L10a2 L11a2 = INDUCTOR
R00a2 R01a2 R02a2 R03a2 R04a2 R05a2 R06a2 R07a2 R08a2 R09a2 R10a2 R11a2 R12a2 R13a2 R14a2 R15a2 R16a2 R17a2 R18a2 R19a2 R20a2 R21a2 R22a2 R23a2 R24a2 R25a2 R26a2 R27a2 R28a2 R29a2 R30a2 R31a2 = RES
U0a2 U1a2 = LF356
U4a2 = ADR12x

## Sheet LTC2194_3.SchDoc
size A; SheetNumber: 8; SheetTotal: 24
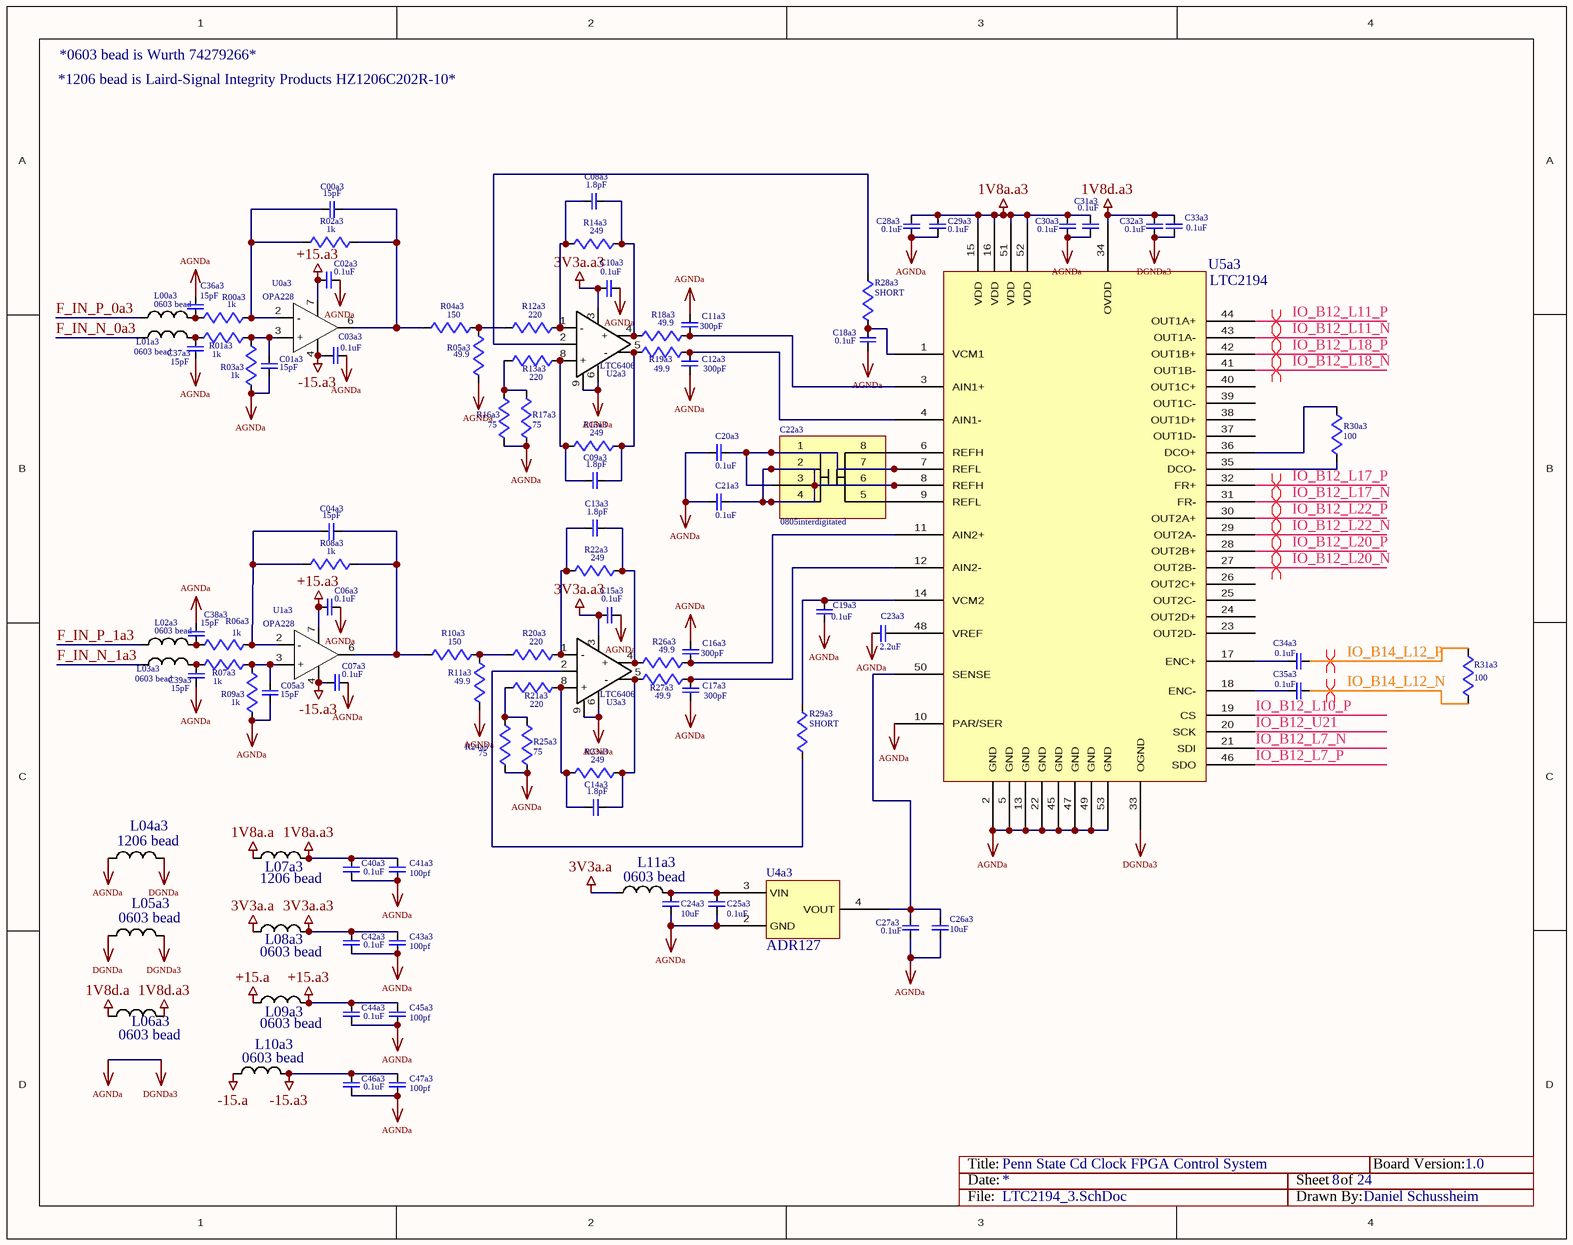
[diagram p21: LTC2194_3.SchDoc]

### Parts
C00a3  15pF  [0603]
C01a3  15pF  [0603]
C02a3  0.1uF  [0603]
C03a3  0.1uF  [0603]
C04a3  15pF  [0603]
C05a3  15pF  [0603]
C06a3  0.1uF  [0603]
C07a3  0.1uF  [0603]
C08a3  1.8pF  [0603]
C09a3  1.8pF  [0603]
C10a3  0.1uF  [0603]
C11a3  300pF  [0603]
C12a3  300pF  [0603]
C13a3  1.8pF  [0603]
C14a3  1.8pF  [0603]
C15a3  0.1uF  [0603]
C16a3  300pF  [0603]
C17a3  300pF  [0603]
C18a3  0.1uF  [0402]
C19a3  0.1uF  [0402]
C20a3  0.1uF  [0402]
C21a3  0.1uF  [0402]
C22a3  0805interdigitated  [0805int]
C23a3  2.2uF  [0402]
C24a3  10uF  [0603]
C25a3  0.1uF  [0603]
C26a3  10uF  [0603]
C27a3  0.1uF  [0603]
C28a3  0.1uF  [0402]
C29a3  0.1uF  [0402]
C30a3  0.1uF  [0402]
C31a3  0.1uF  [0402]
C32a3  0.1uF  [0402]
C33a3  0.1uF  [0402]
C34a3  0.1uF  [0402]
C35a3  0.1uF  [0402]
C36a3  15pF  [0603]
C37a3  15pF  [0603]
C38a3  15pF  [0603]
C39a3  15pF  [0603]
C40a3  0.1uF  [0603]
C41a3  100pf  [0603]
C42a3  0.1uF  [0603]
C43a3  100pf  [0603]
C44a3  0.1uF  [0603]
C45a3  100pf  [0603]
C46a3  0.1uF  [0603]
C47a3  100pf  [0603]
L00a3  0603 bead  [0603]
L01a3  0603 bead  [0603]
L02a3  0603 bead  [0603]
L03a3  0603 bead  [0603]
L04a3  1206 bead  [1206]
L05a3  0603 bead  [0603]
L06a3  0603 bead  [0603]
L07a3  1206 bead  [1206]
L08a3  0603 bead  [0603]
L09a3  0603 bead  [0603]
L10a3  0603 bead  [0603]
L11a3  0603 bead  [0603]
R00a3  1k  [0603]
R01a3  1k  [0603]
R02a3  1k  [0603]
R03a3  1k  [0603]
R04a3  150  [0603]
R05a3  49.9  [0603]
R06a3  1k  [0603]
R07a3  1k  [0603]
R08a3  1k  [0603]
R09a3  1k  [0603]
R10a3  150  [0603]
R11a3  49.9  [0603]
R12a3  220  [0603]
R13a3  220  [0603]
R14a3  249  [0603]
R15a3  249  [0603]
R16a3  75  [0603]
R17a3  75  [0603]
R18a3  49.9  [0603]
R19a3  49.9  [0603]
R20a3  220  [0603]
R21a3  220  [0603]
R22a3  249  [0603]
R23a3  249  [0603]
R24a3  75  [0603]
R25a3  75  [0603]
R26a3  49.9  [0603]
R27a3  49.9  [0603]
R28a3  SHORT  [0603]
R29a3  SHORT  [0603]
R30a3  100  [0603]
R31a3  100  [0402]
U0a3  OPA228  [8SOIC]
U1a3  OPA228  [8SOIC]
U2a3  LTC6406  [8MSOP]
U3a3  LTC6406  [8MSOP]
U4a3  ADR127  [6TSOT]
U5a3  LTC2194  [52QFN]

### Nets
1V8a.a: L07a3.1
1V8a.a3: C28a3.1 C29a3.1 C30a3.1 C31a3.1 C40a3.1 C41a3.1 L07a3.2 U5a3.15(VDD) U5a3.16(VDD) U5a3.51(VDD) U5a3.52(VDD)
1V8d.a: L06a3.1
1V8d.a3: C32a3.1 C33a3.2 L06a3.2 U5a3.34(OVDD)
3V3a.a: L08a3.1 L11a3.1
3V3a.a3: C10a3.1 C15a3.1 C42a3.1 C43a3.1 L08a3.2 U2a3.3(V+) U3a3.3(V+)
+15.a: L09a3.1
+15.a3: C02a3.2 C06a3.2 C44a3.1 C45a3.1 L09a3.2 U0a3.7(V+) U1a3.7(V+)
-15.a: L10a3.1
-15.a3: C03a3.2 C07a3.2 C46a3.1 C47a3.1 L10a3.2 U0a3.4(V-) U1a3.4(V-)
AGNDa: C01a3.2 C02a3.1 C03a3.1 C05a3.2 C06a3.1 C07a3.1 C10a3.2 C11a3.2 C12a3.1 C15a3.2 C16a3.2 C17a3.1 C18a3.1 C19a3.1 C20a3.2 C21a3.2 C23a3.2 C24a3.2 C25a3.2 C26a3.2 C27a3.2 C28a3.2 C29a3.2 C30a3.2 C31a3.2 C32a3.2 C33a3.1 C36a3.1 C37a3.2 C38a3.1 C39a3.2 C40a3.2 C41a3.2 C42a3.2 C43a3.2 C44a3.2 C45a3.2 C46a3.2 C47a3.2 L04a3.1 L04a3.2 L05a3.1 L05a3.2 R03a3.1 R05a3.2 R09a3.1 R11a3.2 R16a3.2 R17a3.2 R24a3.2 R25a3.2 U2a3.6(V-) U2a3.9(V-) U3a3.6(V-) U3a3.9(V-) U4a3.2(GND) U5a3.2(GND) U5a3.5(GND) U5a3.10(PAR/SER) U5a3.13(GND) U5a3.22(GND) U5a3.33(OGND) U5a3.45(GND) U5a3.47(GND) U5a3.49(GND) U5a3.53(GND)  [also labelled DGNDa, DGNDa3]
F_IN_N_0a3: L01a3.1
F_IN_N_1a3: L03a3.1
F_IN_P_0a3: L00a3.1
F_IN_P_1a3: L02a3.1
IO_B12_L7_N: U5a3.21(SDI)
IO_B12_L7_P: U5a3.46(SDO)
IO_B12_L10_P: U5a3.19(CS)
IO_B12_L11_N: U5a3.43(OUT1A-)
IO_B12_L11_P: U5a3.44(OUT1A+)
IO_B12_L17_N: U5a3.31(FR-)
IO_B12_L17_P: U5a3.32(FR+)
IO_B12_L18_N: U5a3.41(OUT1B-)
IO_B12_L18_P: U5a3.42(OUT1B+)
IO_B12_L20_N: U5a3.27(OUT2B-)
IO_B12_L20_P: U5a3.28(OUT2B+)
IO_B12_L22_N: U5a3.29(OUT2A-)
IO_B12_L22_P: U5a3.30(OUT2A+)
IO_B12_U21: U5a3.20(SCK)
IO_B14_L12_N: C35a3.1 R31a3.2
IO_B14_L12_P: C34a3.1 R31a3.1
NetC00a3_1: C00a3.1 R00a3.1 R02a3.2 U0a3.2(-)
NetC00a3_2: C00a3.2 R02a3.1 R04a3.2 U0a3.6(OUT)
NetC01a3_1: C01a3.1 R01a3.1 R03a3.2 U0a3.3(+)
NetC04a3_1: C04a3.1 R06a3.1 R08a3.2 U1a3.2(-)
NetC04a3_2: C04a3.2 R08a3.1 R10a3.2 U1a3.6(OUT)
NetC05a3_1: C05a3.1 R07a3.1 R09a3.2 U1a3.3(+)
NetC08a3_1: C08a3.1 R12a3.1 R14a3.2 U2a3.1(-)
NetC08a3_2: C08a3.2 R14a3.1 R18a3.2 U2a3.4(+)
NetC09a3_1: C09a3.1 R13a3.1 R15a3.2 U2a3.8(+)
NetC09a3_2: C09a3.2 R15a3.1 R19a3.2 U2a3.5(-)
NetC11a3_1: C11a3.1 R18a3.1 U5a3.3(AIN1+)
NetC12a3_2: C12a3.2 R19a3.1 U5a3.4(AIN1-)
NetC13a3_1: C13a3.1 R20a3.1 R22a3.2 U3a3.1(-)
NetC13a3_2: C13a3.2 R22a3.1 R26a3.2 U3a3.4(+)
NetC14a3_1: C14a3.1 R21a3.1 R23a3.2 U3a3.8(+)
NetC14a3_2: C14a3.2 R23a3.1 R27a3.2 U3a3.5(-)
NetC16a3_1: C16a3.1 R26a3.1 U5a3.11(AIN2+)
NetC17a3_2: C17a3.2 R27a3.1 U5a3.12(AIN2-)
NetC18a3_2: C18a3.2 R28a3.2 U5a3.1(VCM1)
NetC19a3_2: C19a3.2 R29a3.1 U5a3.14(VCM2)
NetC20a3_1: C20a3.1 C22a3.1 C22a3.3 C22a3.7 U5a3.7(REFL)
NetC21a3_1: C21a3.1 C22a3.2 C22a3.4 C22a3.6 U5a3.8(REFH)
NetC22a3_5: C22a3.5 U5a3.9(REFL)
NetC22a3_8: C22a3.8 U5a3.6(REFH)
NetC23a3_1: C23a3.1 U5a3.48(VREF)
NetC24a3_1: C24a3.1 C25a3.1 L11a3.2 U4a3.3(VIN)
NetC26a3_1: C26a3.1 C27a3.1 U4a3.4(VOUT) U5a3.50(SENSE)
NetC34a3_2: C34a3.2 U5a3.17(ENC+)
NetC35a3_2: C35a3.2 U5a3.18(ENC-)
NetC36a3_2: C36a3.2 L00a3.2 R00a3.2
NetC37a3_1: C37a3.1 L01a3.2 R01a3.2
NetC38a3_2: C38a3.2 L02a3.2 R06a3.2
NetC39a3_1: C39a3.1 L03a3.2 R07a3.2
NetR04a3_1: R04a3.1 R05a3.1 R12a3.2
NetR10a3_1: R10a3.1 R11a3.1 R20a3.2
NetR13a3_2: R13a3.2 R16a3.1 R17a3.1
NetR21a3_2: R21a3.2 R24a3.1 R25a3.1
NetR28a3_1: R28a3.1 U2a3.2(VOCM)
NetR29a3_2: R29a3.2 U3a3.2(VOCM)
NetR30a3_1: R30a3.1 U5a3.36(DCO+)
NetR30a3_2: R30a3.2 U5a3.35(DCO-)

Not connected (* = marked no-connect by the designer): U5a3 23(OUT2D-) 24(OUT2D+) 25(OUT2C-) 26(OUT2C+) 37(OUT1D-) 38(OUT1D+) 39(OUT1C-) 40(OUT1C+)

### Layout directives
differential pair: IO_B12_L11_N, IO_B12_L11_P, IO_B12_L17_N, IO_B12_L17_P, IO_B12_L18_N, IO_B12_L18_P, IO_B12_L20_N, IO_B12_L20_P, IO_B12_L22_N, IO_B12_L22_P, IO_B14_L12_N, IO_B14_L12_P

### Notes on the sheet
- *1206 bead is Laird-Signal Integrity Products HZ1206C202R-10*
- *0603 bead is Wurth 74279266*
- Title:
- Date:
- Sheet
- of
- Board Version:
- File:
- Drawn By:

### Library data of the parts
C00a3 C01a3 C02a3 C03a3 C04a3 C05a3 C06a3 C07a3 C08a3 C09a3 C10a3 C11a3 C12a3 C13a3 C14a3 C15a3 C16a3 C17a3 C18a3 C19a3 C20a3 C21a3 C23a3 C24a3 C25a3 C26a3 C27a3 C28a3 C29a3 C30a3 C31a3 C32a3 C33a3 C34a3 C35a3 C36a3 C37a3 C38a3 C39a3 C40a3 C41a3 C42a3 C43a3 C44a3 C45a3 C46a3 C47a3 = CAP
C22a3 = 0805intCap
L00a3 L01a3 L02a3 L03a3 L04a3 L05a3 L06a3 L07a3 L08a3 L09a3 L10a3 L11a3 = INDUCTOR
R00a3 R01a3 R02a3 R03a3 R04a3 R05a3 R06a3 R07a3 R08a3 R09a3 R10a3 R11a3 R12a3 R13a3 R14a3 R15a3 R16a3 R17a3 R18a3 R19a3 R20a3 R21a3 R22a3 R23a3 R24a3 R25a3 R26a3 R27a3 R28a3 R29a3 R30a3 R31a3 = RES
U0a3 U1a3 = LF356
U4a3 = ADR12x

## Sheet LTC2194_4.SchDoc
size A; SheetNumber: 9; SheetTotal: 24
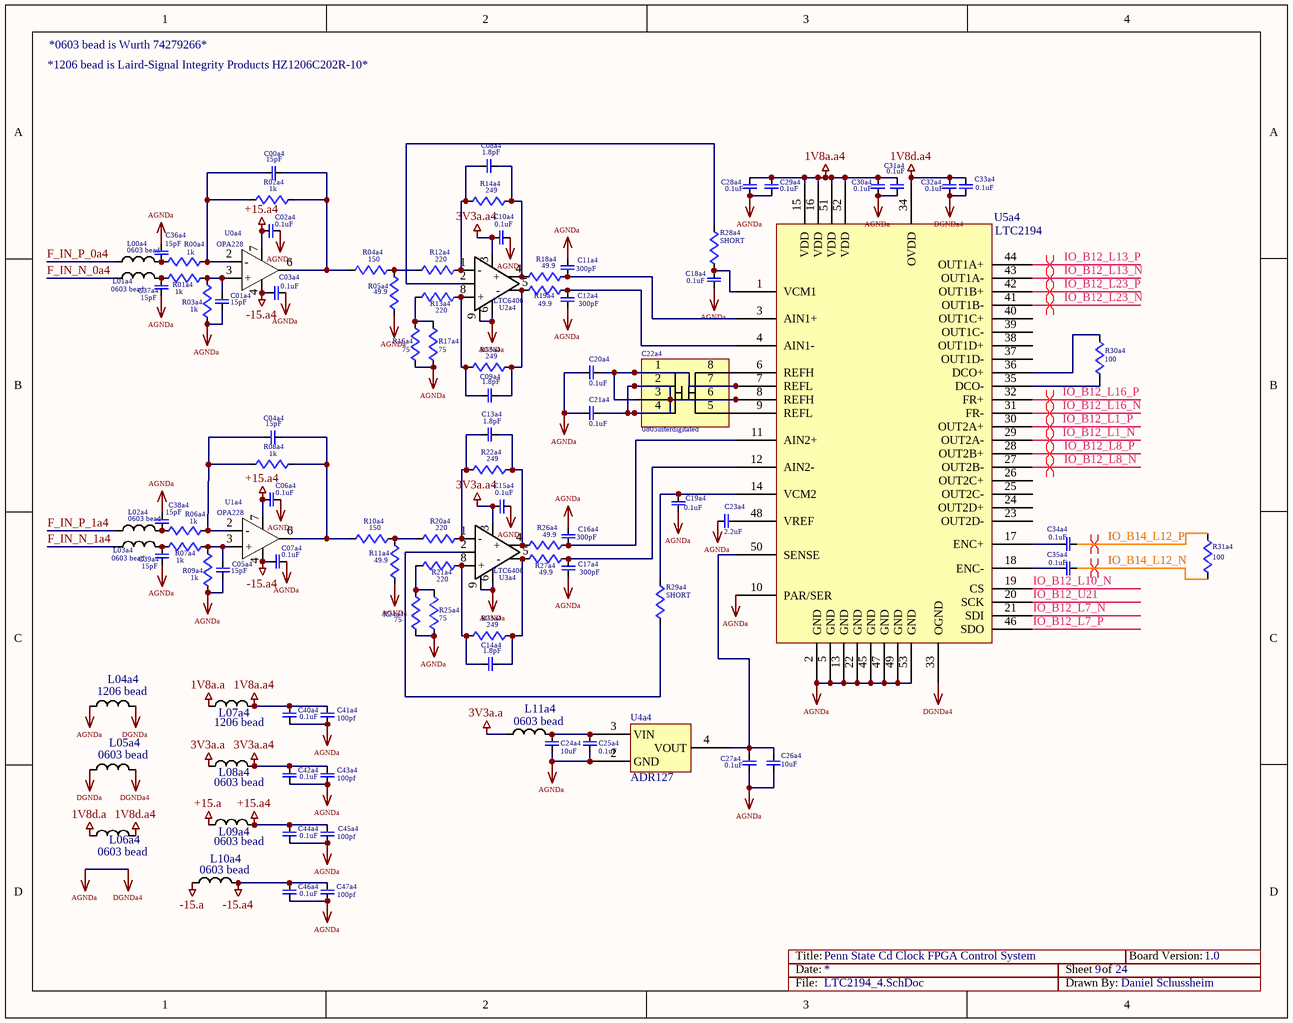
[diagram p22: LTC2194_4.SchDoc]

### Parts
C00a4  15pF  [0603]
C01a4  15pF  [0603]
C02a4  0.1uF  [0603]
C03a4  0.1uF  [0603]
C04a4  15pF  [0603]
C05a4  15pF  [0603]
C06a4  0.1uF  [0603]
C07a4  0.1uF  [0603]
C08a4  1.8pF  [0603]
C09a4  1.8pF  [0603]
C10a4  0.1uF  [0603]
C11a4  300pF  [0603]
C12a4  300pF  [0603]
C13a4  1.8pF  [0603]
C14a4  1.8pF  [0603]
C15a4  0.1uF  [0603]
C16a4  300pF  [0603]
C17a4  300pF  [0603]
C18a4  0.1uF  [0402]
C19a4  0.1uF  [0402]
C20a4  0.1uF  [0402]
C21a4  0.1uF  [0402]
C22a4  0805interdigitated  [0805int]
C23a4  2.2uF  [0402]
C24a4  10uF  [0603]
C25a4  0.1uF  [0603]
C26a4  10uF  [0603]
C27a4  0.1uF  [0603]
C28a4  0.1uF  [0402]
C29a4  0.1uF  [0402]
C30a4  0.1uF  [0402]
C31a4  0.1uF  [0402]
C32a4  0.1uF  [0402]
C33a4  0.1uF  [0402]
C34a4  0.1uF  [0402]
C35a4  0.1uF  [0402]
C36a4  15pF  [0603]
C37a4  15pF  [0603]
C38a4  15pF  [0603]
C39a4  15pF  [0603]
C40a4  0.1uF  [0603]
C41a4  100pf  [0603]
C42a4  0.1uF  [0603]
C43a4  100pf  [0603]
C44a4  0.1uF  [0603]
C45a4  100pf  [0603]
C46a4  0.1uF  [0603]
C47a4  100pf  [0603]
L00a4  0603 bead  [0603]
L01a4  0603 bead  [0603]
L02a4  0603 bead  [0603]
L03a4  0603 bead  [0603]
L04a4  1206 bead  [1206]
L05a4  0603 bead  [0603]
L06a4  0603 bead  [0603]
L07a4  1206 bead  [1206]
L08a4  0603 bead  [0603]
L09a4  0603 bead  [0603]
L10a4  0603 bead  [0603]
L11a4  0603 bead  [0603]
R00a4  1k  [0603]
R01a4  1k  [0603]
R02a4  1k  [0603]
R03a4  1k  [0603]
R04a4  150  [0603]
R05a4  49.9  [0603]
R06a4  1k  [0603]
R07a4  1k  [0603]
R08a4  1k  [0603]
R09a4  1k  [0603]
R10a4  150  [0603]
R11a4  49.9  [0603]
R12a4  220  [0603]
R13a4  220  [0603]
R14a4  249  [0603]
R15a4  249  [0603]
R16a4  75  [0603]
R17a4  75  [0603]
R18a4  49.9  [0603]
R19a4  49.9  [0603]
R20a4  220  [0603]
R21a4  220  [0603]
R22a4  249  [0603]
R23a4  249  [0603]
R24a4  75  [0603]
R25a4  75  [0603]
R26a4  49.9  [0603]
R27a4  49.9  [0603]
R28a4  SHORT  [0603]
R29a4  SHORT  [0603]
R30a4  100  [0603]
R31a4  100  [0402]
U0a4  OPA228  [8SOIC]
U1a4  OPA228  [8SOIC]
U2a4  LTC6406  [8MSOP]
U3a4  LTC6406  [8MSOP]
U4a4  ADR127  [6TSOT]
U5a4  LTC2194  [52QFN]

### Nets
1V8a.a: L07a4.1
1V8a.a4: C28a4.1 C29a4.1 C30a4.1 C31a4.1 C40a4.1 C41a4.1 L07a4.2 U5a4.15(VDD) U5a4.16(VDD) U5a4.51(VDD) U5a4.52(VDD)
1V8d.a: L06a4.1
1V8d.a4: C32a4.1 C33a4.2 L06a4.2 U5a4.34(OVDD)
3V3a.a: L08a4.1 L11a4.1
3V3a.a4: C10a4.1 C15a4.1 C42a4.1 C43a4.1 L08a4.2 U2a4.3(V+) U3a4.3(V+)
+15.a: L09a4.1
+15.a4: C02a4.2 C06a4.2 C44a4.1 C45a4.1 L09a4.2 U0a4.7(V+) U1a4.7(V+)
-15.a: L10a4.1
-15.a4: C03a4.2 C07a4.2 C46a4.1 C47a4.1 L10a4.2 U0a4.4(V-) U1a4.4(V-)
AGNDa: C01a4.2 C02a4.1 C03a4.1 C05a4.2 C06a4.1 C07a4.1 C10a4.2 C11a4.2 C12a4.1 C15a4.2 C16a4.2 C17a4.1 C18a4.1 C19a4.1 C20a4.2 C21a4.2 C23a4.2 C24a4.2 C25a4.2 C26a4.2 C27a4.2 C28a4.2 C29a4.2 C30a4.2 C31a4.2 C32a4.2 C33a4.1 C36a4.1 C37a4.2 C38a4.1 C39a4.2 C40a4.2 C41a4.2 C42a4.2 C43a4.2 C44a4.2 C45a4.2 C46a4.2 C47a4.2 L04a4.1 L04a4.2 L05a4.1 L05a4.2 R03a4.1 R05a4.2 R09a4.1 R11a4.2 R16a4.2 R17a4.2 R24a4.2 R25a4.2 U2a4.6(V-) U2a4.9(V-) U3a4.6(V-) U3a4.9(V-) U4a4.2(GND) U5a4.2(GND) U5a4.5(GND) U5a4.10(PAR/SER) U5a4.13(GND) U5a4.22(GND) U5a4.33(OGND) U5a4.45(GND) U5a4.47(GND) U5a4.49(GND) U5a4.53(GND)  [also labelled DGNDa, DGNDa4]
F_IN_N_0a4: L01a4.1
F_IN_N_1a4: L03a4.1
F_IN_P_0a4: L00a4.1
F_IN_P_1a4: L02a4.1
IO_B12_L1_N: U5a4.29(OUT2A-)
IO_B12_L1_P: U5a4.30(OUT2A+)
IO_B12_L7_N: U5a4.21(SDI)
IO_B12_L7_P: U5a4.46(SDO)
IO_B12_L8_N: U5a4.27(OUT2B-)
IO_B12_L8_P: U5a4.28(OUT2B+)
IO_B12_L10_N: U5a4.19(CS)
IO_B12_L13_N: U5a4.43(OUT1A-)
IO_B12_L13_P: U5a4.44(OUT1A+)
IO_B12_L16_N: U5a4.31(FR-)
IO_B12_L16_P: U5a4.32(FR+)
IO_B12_L23_N: U5a4.41(OUT1B-)
IO_B12_L23_P: U5a4.42(OUT1B+)
IO_B12_U21: U5a4.20(SCK)
IO_B14_L12_N: C35a4.1 R31a4.2
IO_B14_L12_P: C34a4.1 R31a4.1
NetC00a4_1: C00a4.1 R00a4.1 R02a4.2 U0a4.2(-)
NetC00a4_2: C00a4.2 R02a4.1 R04a4.2 U0a4.6(OUT)
NetC01a4_1: C01a4.1 R01a4.1 R03a4.2 U0a4.3(+)
NetC04a4_1: C04a4.1 R06a4.1 R08a4.2 U1a4.2(-)
NetC04a4_2: C04a4.2 R08a4.1 R10a4.2 U1a4.6(OUT)
NetC05a4_1: C05a4.1 R07a4.1 R09a4.2 U1a4.3(+)
NetC08a4_1: C08a4.1 R12a4.1 R14a4.2 U2a4.1(-)
NetC08a4_2: C08a4.2 R14a4.1 R18a4.2 U2a4.4(+)
NetC09a4_1: C09a4.1 R13a4.1 R15a4.2 U2a4.8(+)
NetC09a4_2: C09a4.2 R15a4.1 R19a4.2 U2a4.5(-)
NetC11a4_1: C11a4.1 R18a4.1 U5a4.3(AIN1+)
NetC12a4_2: C12a4.2 R19a4.1 U5a4.4(AIN1-)
NetC13a4_1: C13a4.1 R20a4.1 R22a4.2 U3a4.1(-)
NetC13a4_2: C13a4.2 R22a4.1 R26a4.2 U3a4.4(+)
NetC14a4_1: C14a4.1 R21a4.1 R23a4.2 U3a4.8(+)
NetC14a4_2: C14a4.2 R23a4.1 R27a4.2 U3a4.5(-)
NetC16a4_1: C16a4.1 R26a4.1 U5a4.11(AIN2+)
NetC17a4_2: C17a4.2 R27a4.1 U5a4.12(AIN2-)
NetC18a4_2: C18a4.2 R28a4.2 U5a4.1(VCM1)
NetC19a4_2: C19a4.2 R29a4.1 U5a4.14(VCM2)
NetC20a4_1: C20a4.1 C22a4.1 C22a4.3 C22a4.7 U5a4.7(REFL)
NetC21a4_1: C21a4.1 C22a4.2 C22a4.4 C22a4.6 U5a4.8(REFH)
NetC22a4_5: C22a4.5 U5a4.9(REFL)
NetC22a4_8: C22a4.8 U5a4.6(REFH)
NetC23a4_1: C23a4.1 U5a4.48(VREF)
NetC24a4_1: C24a4.1 C25a4.1 L11a4.2 U4a4.3(VIN)
NetC26a4_1: C26a4.1 C27a4.1 U4a4.4(VOUT) U5a4.50(SENSE)
NetC34a4_2: C34a4.2 U5a4.17(ENC+)
NetC35a4_2: C35a4.2 U5a4.18(ENC-)
NetC36a4_2: C36a4.2 L00a4.2 R00a4.2
NetC37a4_1: C37a4.1 L01a4.2 R01a4.2
NetC38a4_2: C38a4.2 L02a4.2 R06a4.2
NetC39a4_1: C39a4.1 L03a4.2 R07a4.2
NetR04a4_1: R04a4.1 R05a4.1 R12a4.2
NetR10a4_1: R10a4.1 R11a4.1 R20a4.2
NetR13a4_2: R13a4.2 R16a4.1 R17a4.1
NetR21a4_2: R21a4.2 R24a4.1 R25a4.1
NetR28a4_1: R28a4.1 U2a4.2(VOCM)
NetR29a4_2: R29a4.2 U3a4.2(VOCM)
NetR30a4_1: R30a4.1 U5a4.36(DCO+)
NetR30a4_2: R30a4.2 U5a4.35(DCO-)

Not connected (* = marked no-connect by the designer): U5a4 23(OUT2D-) 24(OUT2D+) 25(OUT2C-) 26(OUT2C+) 37(OUT1D-) 38(OUT1D+) 39(OUT1C-) 40(OUT1C+)

### Layout directives
differential pair: IO_B12_L1_N, IO_B12_L1_P, IO_B12_L8_N, IO_B12_L8_P, IO_B12_L13_N, IO_B12_L13_P, IO_B12_L16_N, IO_B12_L16_P, IO_B12_L23_N, IO_B12_L23_P, IO_B14_L12_N, IO_B14_L12_P

### Notes on the sheet
- *1206 bead is Laird-Signal Integrity Products HZ1206C202R-10*
- *0603 bead is Wurth 74279266*
- Title:
- Date:
- Sheet
- of
- Board Version:
- File:
- Drawn By:

### Library data of the parts
C00a4 C01a4 C02a4 C03a4 C04a4 C05a4 C06a4 C07a4 C08a4 C09a4 C10a4 C11a4 C12a4 C13a4 C14a4 C15a4 C16a4 C17a4 C18a4 C19a4 C20a4 C21a4 C23a4 C24a4 C25a4 C26a4 C27a4 C28a4 C29a4 C30a4 C31a4 C32a4 C33a4 C34a4 C35a4 C36a4 C37a4 C38a4 C39a4 C40a4 C41a4 C42a4 C43a4 C44a4 C45a4 C46a4 C47a4 = CAP
C22a4 = 0805intCap
L00a4 L01a4 L02a4 L03a4 L04a4 L05a4 L06a4 L07a4 L08a4 L09a4 L10a4 L11a4 = INDUCTOR
R00a4 R01a4 R02a4 R03a4 R04a4 R05a4 R06a4 R07a4 R08a4 R09a4 R10a4 R11a4 R12a4 R13a4 R14a4 R15a4 R16a4 R17a4 R18a4 R19a4 R20a4 R21a4 R22a4 R23a4 R24a4 R25a4 R26a4 R27a4 R28a4 R29a4 R30a4 R31a4 = RES
U0a4 U1a4 = LF356
U4a4 = ADR12x

## Sheet ModuleConnectorB.SchDoc
size A portrait; DocumentNumber: 1; SheetNumber: 2; SheetTotal: 24
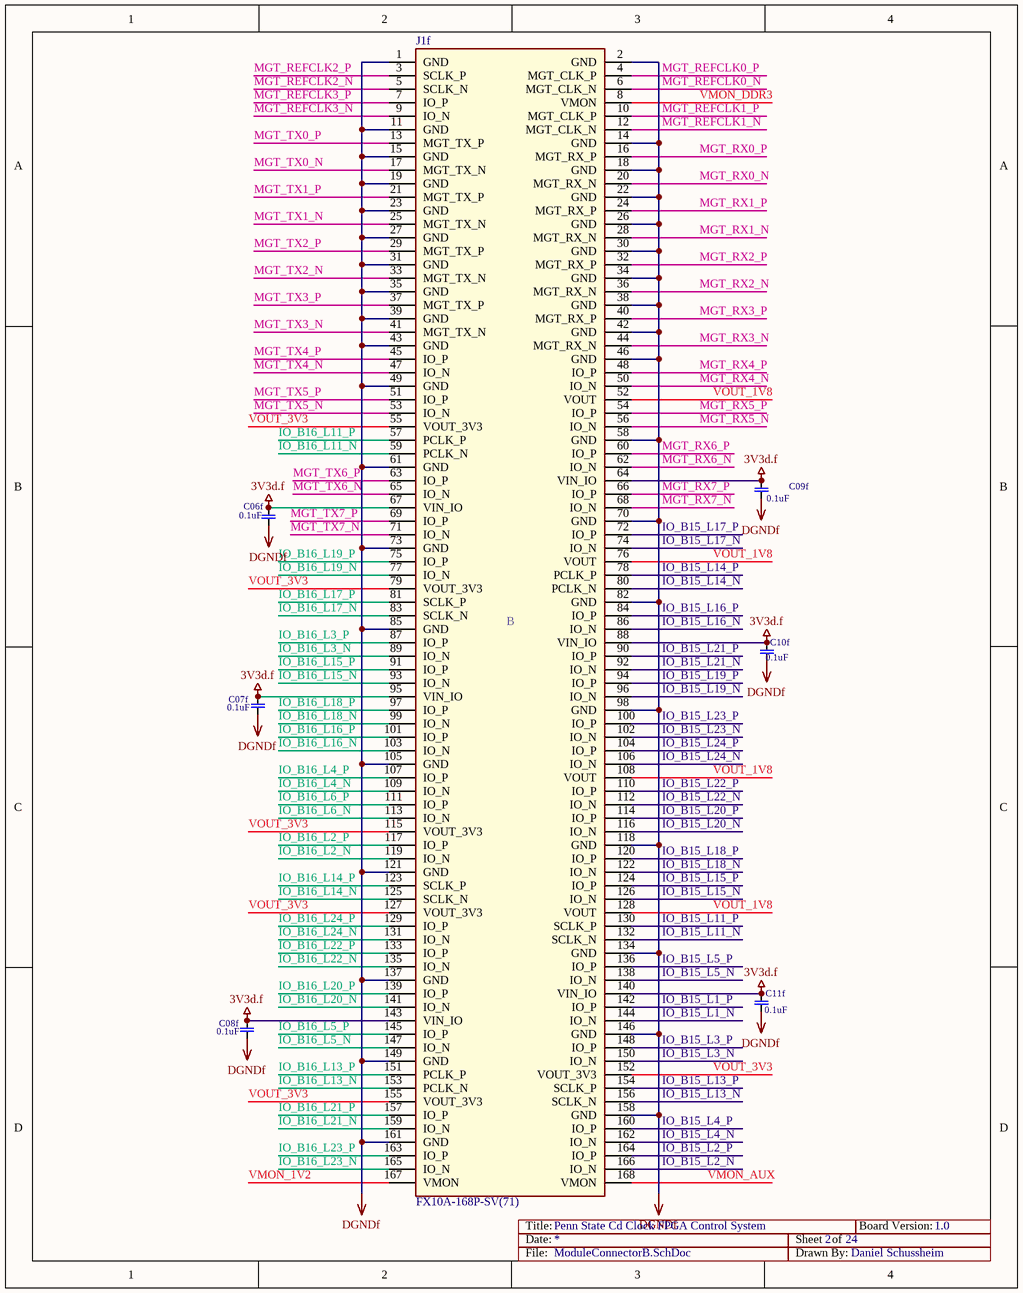
[diagram p23: ModuleConnectorB.SchDoc]

### Parts
C06f  0.1uF  [0603]
C07f  0.1uF  [0603]
C08f  0.1uF  [0603]
C09f  0.1uF  [0603]
C10f  0.1uF  [0603]
C11f  0.1uF  [0603]
J1f  FX10A-168P-SV(71)  [Mercury_Baseboard_Connector]

### Nets
3V3d.f: C06f.1 C07f.1 C08f.1 C09f.1 C10f.1 C11f.1 J1f.64(VIN_IO) J1f.67(VIN_IO) J1f.88(VIN_IO) J1f.95(VIN_IO) J1f.140(VIN_IO) J1f.143(VIN_IO)
DGNDf: C06f.2 C07f.2 C08f.2 C09f.2 C10f.2 C11f.2 J1f.1(GND) J1f.2(GND) J1f.11(GND) J1f.14(GND) J1f.15(GND) J1f.18(GND) J1f.19(GND) J1f.22(GND) J1f.23(GND) J1f.26(GND) J1f.27(GND) J1f.30(GND) J1f.31(GND) J1f.34(GND) J1f.35(GND) J1f.38(GND) J1f.39(GND) J1f.42(GND) J1f.43(GND) J1f.46(GND) J1f.49(GND) J1f.58(GND) J1f.61(GND) J1f.70(GND) J1f.73(GND) J1f.82(GND) J1f.85(GND) J1f.98(GND) J1f.105(GND) J1f.118(GND) J1f.121(GND) J1f.134(GND) J1f.137(GND) J1f.146(GND) J1f.149(GND) J1f.158(GND) J1f.161(GND)  [project net AGNDa]
IO_B15_L1_N: J1f.144(IO_N)
IO_B15_L1_P: J1f.142(IO_P)
IO_B15_L2_N: J1f.166(IO_N)
IO_B15_L2_P: J1f.164(IO_P)
IO_B15_L3_N: J1f.150(IO_N)
IO_B15_L3_P: J1f.148(IO_P)
IO_B15_L4_N: J1f.162(IO_N)
IO_B15_L4_P: J1f.160(IO_P)
IO_B15_L5_N: J1f.138(IO_N)
IO_B15_L5_P: J1f.136(IO_P)
IO_B15_L11_N: J1f.132(SCLK_N)
IO_B15_L11_P: J1f.130(SCLK_P)
IO_B15_L13_N: J1f.156(SCLK_N)
IO_B15_L13_P: J1f.154(SCLK_P)
IO_B15_L14_N: J1f.80(PCLK_N)
IO_B15_L14_P: J1f.78(PCLK_P)
IO_B15_L15_N: J1f.126(IO_N)
IO_B15_L15_P: J1f.124(IO_P)
IO_B15_L16_N: J1f.86(IO_N)
IO_B15_L16_P: J1f.84(IO_P)
IO_B15_L17_N: J1f.74(IO_N)
IO_B15_L17_P: J1f.72(IO_P)
IO_B15_L18_N: J1f.122(IO_N)
IO_B15_L18_P: J1f.120(IO_P)
IO_B15_L19_N: J1f.96(IO_N)
IO_B15_L19_P: J1f.94(IO_P)
IO_B15_L20_N: J1f.116(IO_N)
IO_B15_L20_P: J1f.114(IO_P)
IO_B15_L21_N: J1f.92(IO_N)
IO_B15_L21_P: J1f.90(IO_P)
IO_B15_L22_N: J1f.112(IO_N)
IO_B15_L22_P: J1f.110(IO_P)
IO_B15_L23_N: J1f.102(IO_N)
IO_B15_L23_P: J1f.100(IO_P)
IO_B15_L24_N: J1f.106(IO_N)
IO_B15_L24_P: J1f.104(IO_P)
IO_B16_L2_N: J1f.119(IO_N)
IO_B16_L2_P: J1f.117(IO_P)
IO_B16_L3_N: J1f.89(IO_N)
IO_B16_L3_P: J1f.87(IO_P)
IO_B16_L4_N: J1f.109(IO_N)
IO_B16_L4_P: J1f.107(IO_P)
IO_B16_L5_N: J1f.147(IO_N)
IO_B16_L5_P: J1f.145(IO_P)
IO_B16_L6_N: J1f.113(IO_N)
IO_B16_L6_P: J1f.111(IO_P)
IO_B16_L11_N: J1f.59(PCLK_N)
IO_B16_L11_P: J1f.57(PCLK_P)
IO_B16_L13_N: J1f.153(PCLK_N)
IO_B16_L13_P: J1f.151(PCLK_P)
IO_B16_L14_N: J1f.125(SCLK_N)
IO_B16_L14_P: J1f.123(SCLK_P)
IO_B16_L15_N: J1f.93(IO_N)
IO_B16_L15_P: J1f.91(IO_P)
IO_B16_L16_N: J1f.103(IO_N)
IO_B16_L16_P: J1f.101(IO_P)
IO_B16_L17_N: J1f.83(SCLK_N)
IO_B16_L17_P: J1f.81(SCLK_P)
IO_B16_L18_N: J1f.99(IO_N)
IO_B16_L18_P: J1f.97(IO_P)
IO_B16_L19_N: J1f.77(IO_N)
IO_B16_L19_P: J1f.75(IO_P)
IO_B16_L20_N: J1f.141(IO_N)
IO_B16_L20_P: J1f.139(IO_P)
IO_B16_L21_N: J1f.159(IO_N)
IO_B16_L21_P: J1f.157(IO_P)
IO_B16_L22_N: J1f.135(IO_N)
IO_B16_L22_P: J1f.133(IO_P)
IO_B16_L23_N: J1f.165(IO_N)
IO_B16_L23_P: J1f.163(IO_P)
IO_B16_L24_N: J1f.131(IO_N)
IO_B16_L24_P: J1f.129(IO_P)
MGT_REFCLK0_N: J1f.6(MGT_CLK_N)
MGT_REFCLK0_P: J1f.4(MGT_CLK_P)
MGT_REFCLK1_N: J1f.12(MGT_CLK_N)
MGT_REFCLK1_P: J1f.10(MGT_CLK_P)
MGT_REFCLK2_N: J1f.5(SCLK_N)
MGT_REFCLK2_P: J1f.3(SCLK_P)
MGT_REFCLK3_N: J1f.9(IO_N)
MGT_REFCLK3_P: J1f.7(IO_P)
MGT_RX0_N: J1f.20(MGT_RX_N)
MGT_RX0_P: J1f.16(MGT_RX_P)
MGT_RX1_N: J1f.28(MGT_RX_N)
MGT_RX1_P: J1f.24(MGT_RX_P)
MGT_RX2_N: J1f.36(MGT_RX_N)
MGT_RX2_P: J1f.32(MGT_RX_P)
MGT_RX3_N: J1f.44(MGT_RX_N)
MGT_RX3_P: J1f.40(MGT_RX_P)
MGT_RX4_N: J1f.50(IO_N)
MGT_RX4_P: J1f.48(IO_P)
MGT_RX5_N: J1f.56(IO_N)
MGT_RX5_P: J1f.54(IO_P)
MGT_RX6_N: J1f.62(IO_N)
MGT_RX6_P: J1f.60(IO_P)
MGT_RX7_N: J1f.68(IO_N)
MGT_RX7_P: J1f.66(IO_P)
MGT_TX0_N: J1f.17(MGT_TX_N)
MGT_TX0_P: J1f.13(MGT_TX_P)
MGT_TX1_N: J1f.25(MGT_TX_N)
MGT_TX1_P: J1f.21(MGT_TX_P)
MGT_TX2_N: J1f.33(MGT_TX_N)
MGT_TX2_P: J1f.29(MGT_TX_P)
MGT_TX3_N: J1f.41(MGT_TX_N)
MGT_TX3_P: J1f.37(MGT_TX_P)
MGT_TX4_N: J1f.47(IO_N)
MGT_TX4_P: J1f.45(IO_P)
MGT_TX5_N: J1f.53(IO_N)
MGT_TX5_P: J1f.51(IO_P)
MGT_TX6_N: J1f.65(IO_N)
MGT_TX6_P: J1f.63(IO_P)
MGT_TX7_N: J1f.71(IO_N)
MGT_TX7_P: J1f.69(IO_P)
VMON_1V2: J1f.167(VMON)
VMON_AUX: J1f.168(VMON)
VMON_DDR3: J1f.8(VMON)
VOUT_1V8: J1f.52(VOUT) J1f.76(VOUT) J1f.108(VOUT) J1f.128(VOUT)
VOUT_3V3: J1f.55(VOUT_3V3) J1f.79(VOUT_3V3) J1f.115(VOUT_3V3) J1f.127(VOUT_3V3) J1f.152(VOUT_3V3) J1f.155(VOUT_3V3)

### Notes on the sheet
- (near J1f) Title:
- (near J1f) Date:
- Sheet
- of
- Board Version:
- File:
- Drawn By:
- (in symbol Mercury_Baseboard_Connector-B) B

### Library data of the parts
C06f C07f C08f C09f C10f C11f = CAP
J1f = Mercury_Baseboard_Connector-B: Mercury Baseboard Connector; Manufacturer: Hirose; DistPartNumber: FX10A-168P-SV(71)-ND; Board_Variant: ALL; Check Sch: CG_2015-03-03; Enclustra PN: EN100374; Geometry.Height: 4mm stack height; Distributor: Digikey; Package: SMD - 168pin Hirose; ROHS: Yes; Characteristics: -; Supplier: Enclustra; Check PCB: -; Cost: 4.50; ManufPartNumber: FX10A-168P-SV(71); Temperature: -55..+85°C; Type: Connector; Value: FX10A-168P-SV(71)